# Altium project PCB_Project.PrjPcb (part 1 of 2)
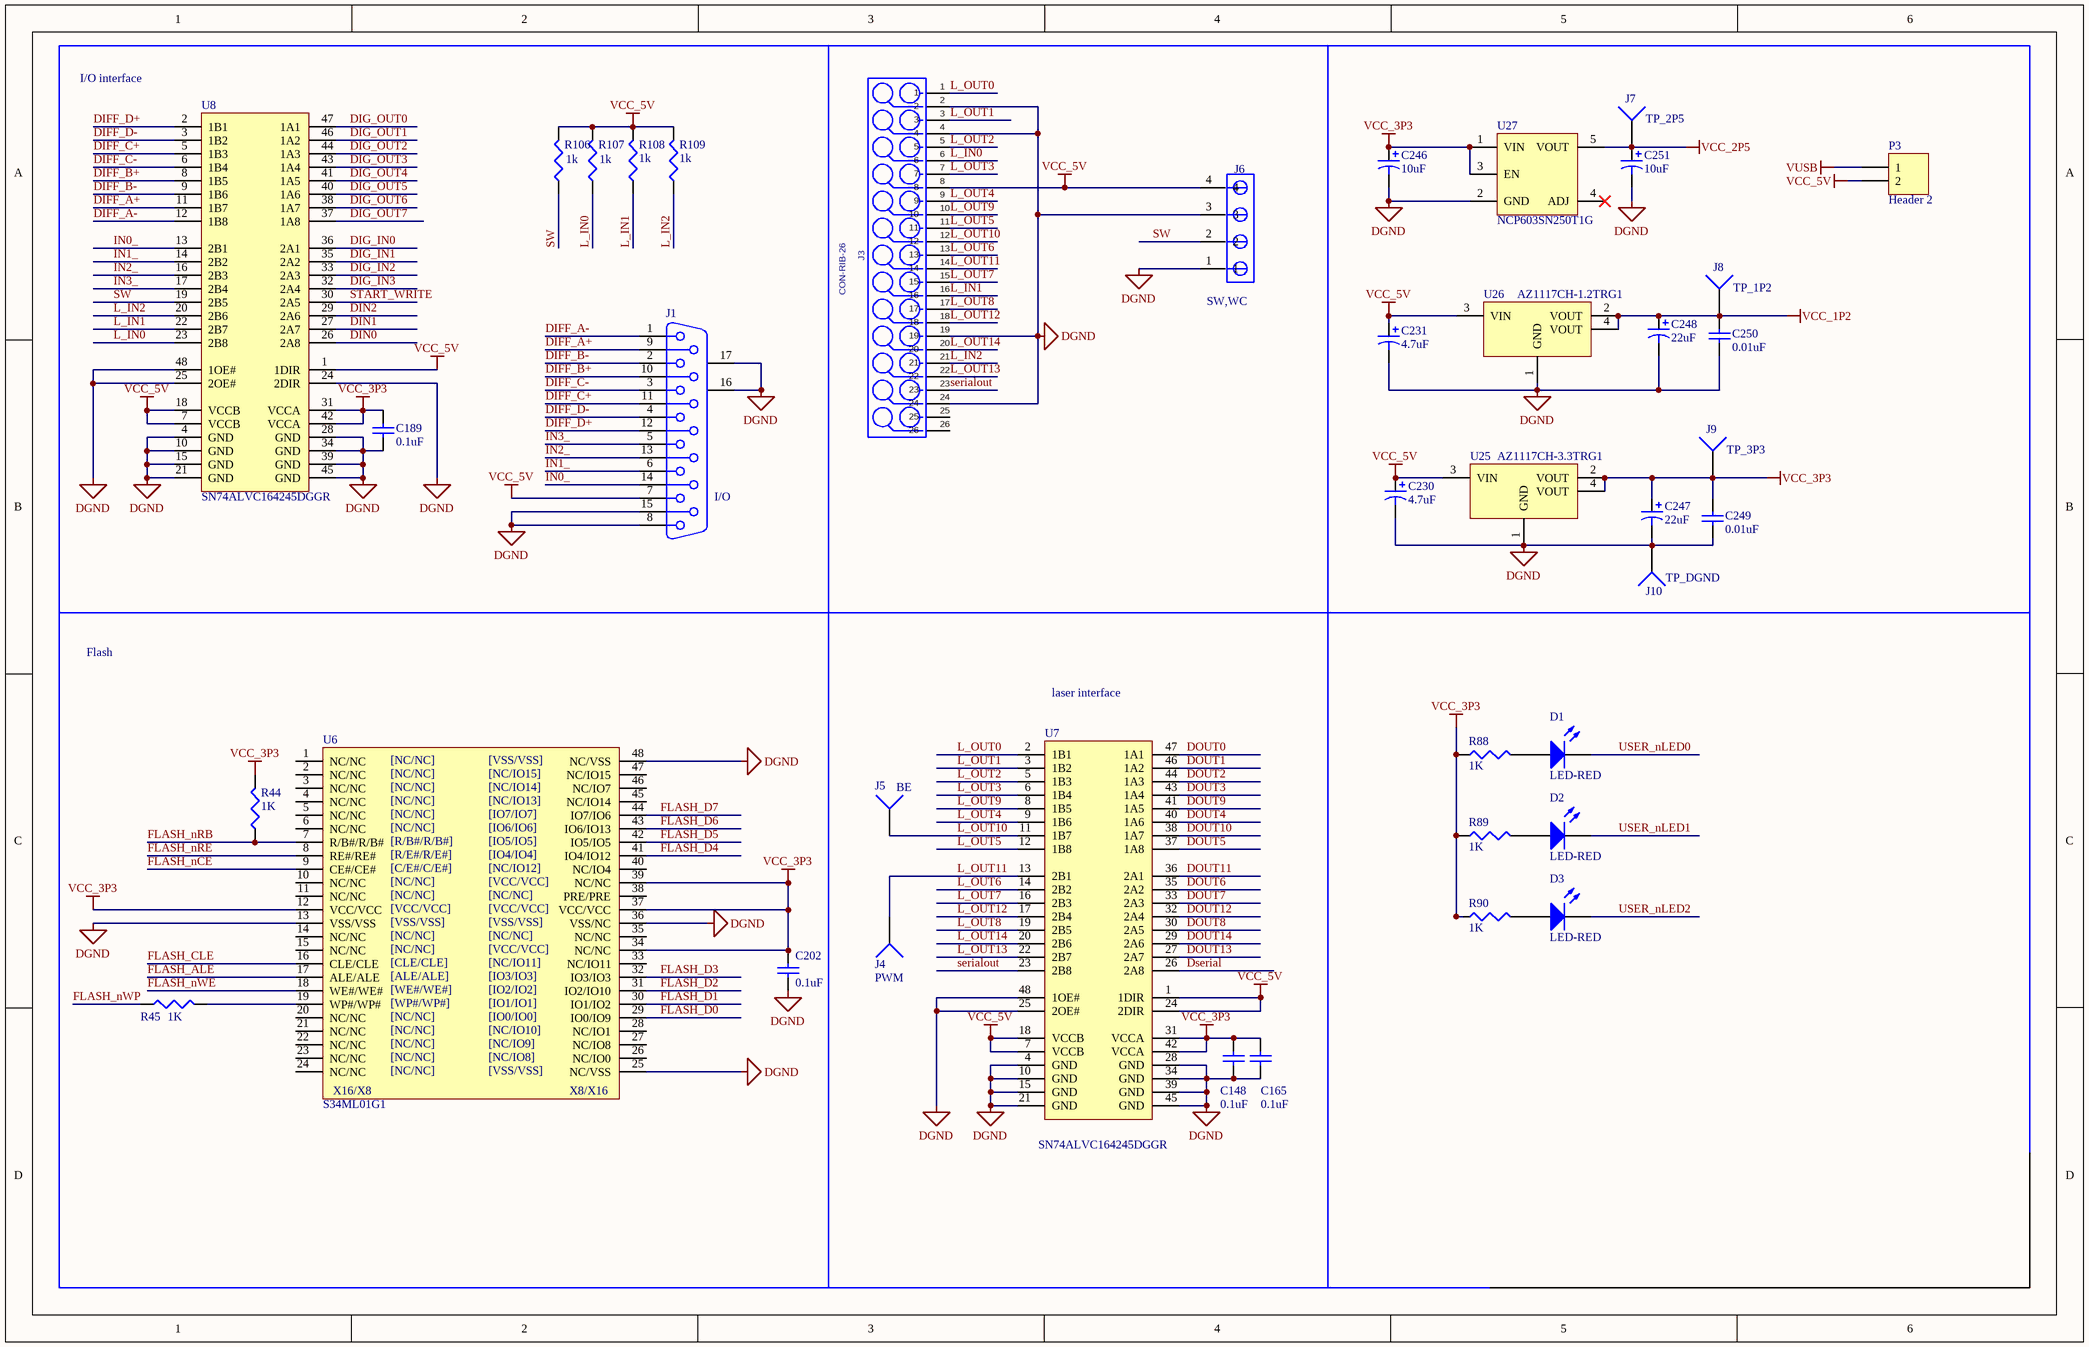
[diagram p0: interface.SchDoc]
6 sheets, 207 parts. Net scope: global (net labels, ports and power ports of the same name join across sheets).
Board file: pcb_apex_v3.2.1.PcbDoc
Sheets:
  interface.SchDoc
  fx3_a.SchDoc
  fx3_b.SchDoc
  ep4ce30_a.SchDoc
  ep4ce30_b.SchDoc
  ep4ce30_c.SchDoc

## Sheet interface.SchDoc: Interface
size OrCAD B; CheckedBy: liuchao; DrawnBy: liuchao; DocumentNumber: APEX-USB7; Revision: 3.0.0; SheetNumber: 7; SheetTotal: 9

### Parts
C148  value 0.1uF  [C_0402]  (hidden comment: Capacitor)
C165  value 0.1uF  [C_0402]  (hidden comment: Capacitor)
C189  value 0.1uF  [C_0402]  (hidden comment: Capacitor)
C202  value 0.1uF  [C_0402]  (hidden comment: Capacitor)
C230  value 4.7uF  [CAP_B]  (hidden comment: Polarized Capacitor)
C231  value 4.7uF  [CAP_B]  (hidden comment: Polarized Capacitor)
C246  value 10uF  [CAP_B]  (hidden comment: Polarized Capacitor)
C247  value 22uF  [CAP_B]  (hidden comment: Polarized Capacitor)
C248  value 22uF  [CAP_B]  (hidden comment: Polarized Capacitor)
C249  value 0.01uF  [C_0402]  (hidden comment: Capacitor)
C250  value 0.01uF  [C_0402]  (hidden comment: Capacitor)
C251  value 10uF  [CAP_B]  (hidden comment: Polarized Capacitor)
D1  LED-RED  [3.2X1.6X1.1]
D2  LED-RED  [3.2X1.6X1.1]
D3  LED-RED  [3.2X1.6X1.1]
J1  I/O  [DB15]
J3  CON-RIB-26  [H26-2P54-DIP]
J4  PWM  [1PAD]
J5  BE  [1PAD]
J6  value SW,WC  [2510-4P]  (hidden comment: SIP-4P-100)
J7  TP_2P5  [1PAD]
J8  TP_1P2  [1PAD]
J9  TP_3P3  [1PAD]
J10  TP_DGND  [1PAD]
P3  Header 2  [HDR1X2]
R44  value 1K  [J1-0603]  (hidden comment: Resistor)
R45  value 1K  [J1-0603]  (hidden comment: Resistor)
R88  value 1K  [J1-0603]  (hidden comment: Resistor)
R89  value 1K  [J1-0603]  (hidden comment: Resistor)
R90  value 1K  [J1-0603]  (hidden comment: Resistor)
R106  value 1k  [J1-0603]  (hidden comment: Resistor)
R107  value 1k  [J1-0603]  (hidden comment: Resistor)
R108  value 1k  [J1-0603]  (hidden comment: Resistor)
R109  value 1k  [J1-0603]  (hidden comment: Resistor)
U6  S34ML01G1  [TSOP48]
U7  SN74ALVC164245DGGR  [TSSOP48_N]
U8  SN74ALVC164245DGGR  [TSSOP48_N]
U25  AZ1117CH-3.3TRG1  [SOT223_N]
U26  AZ1117CH-1.2TRG1  [SOT223_N]
U27  NCP603SN250T1G  [TSOP_5]

### Nets
DGND: C148.2 C165.1 C189.1 C202.1 C230.2 C231.2 C246.2 C247.2 C248.2 C249.2 C250.2 C251.2 J1.8 J1.15 J1.16(MH1) J1.17(MH2) J3.2 J3.4 J3.19 J3.24 J6.1 J6.3 J10.1 U6.13(VSS/VSS) U6.25(NC/VSS) U6.36(VSS/NC) U6.48(NC/VSS) U7.4(GND) U7.10(GND) U7.15(GND) U7.21(GND) U7.25(2OE#) U7.28(GND) U7.34(GND) U7.39(GND) U7.45(GND) U7.48(1OE#) U8.4(GND) U8.10(GND) U8.15(GND) U8.21(GND) U8.24(2DIR) U8.25(2OE#) U8.28(GND) U8.34(GND) U8.39(GND) U8.45(GND) U8.48(1OE#) U25.1(GND) U26.1(GND) U27.2(GND)
VCC_1P2: C248.1 C250.1 J8.1 U26.2(VOUT) U26.4(VOUT)
VCC_2P5: C251.1 J7.1 U27.5(VOUT)
VCC_3P3: C148.1 C165.2 C189.2 C202.2 C246.1 C247.1 C249.1 J9.1 R44.2 R88.1 R89.1 R90.1 U6.12(VCC/VCC) U6.34(NC/NC) U6.37(VCC/VCC) U6.39(NC/NC) U7.31(VCCA) U7.42(VCCA) U8.31(VCCA) U8.42(VCCA) U25.2(VOUT) U25.4(VOUT) U27.1(VIN) U27.3(EN)
VCC_5V: C230.1 C231.1 J1.7 J3.8 J6.4 P3.2 R106.2 R107.2 R108.2 R109.2 U7.1(1DIR) U7.7(VCCB) U7.18(VCCB) U7.24(2DIR) U8.1(1DIR) U8.7(VCCB) U8.18(VCCB) U25.3(VIN) U26.3(VIN)
VUSB: P3.1
DIFF_A+: J1.9 U8.11(1B7)
DIFF_A-: J1.1 U8.12(1B8)
DIFF_B+: J1.10 U8.8(1B5)
DIFF_B-: J1.2 U8.9(1B6)
DIFF_C+: J1.11 U8.5(1B3)
DIFF_C-: J1.3 U8.6(1B4)
DIFF_D+: J1.12 U8.2(1B1)
DIFF_D-: J1.4 U8.3(1B2)
DIG_IN0: U8.36(2A1)
DIG_IN1: U8.35(2A2)
DIG_IN2: U8.33(2A3)
DIG_IN3: U8.32(2A4)
DIG_OUT0: U8.47(1A1)
DIG_OUT1: U8.46(1A2)
DIG_OUT2: U8.44(1A3)
DIG_OUT3: U8.43(1A4)
DIG_OUT4: U8.41(1A5)
DIG_OUT5: U8.40(1A6)
DIG_OUT6: U8.38(1A7)
DIG_OUT7: U8.37(1A8)
DIN0: U8.26(2A8)
DIN1: U8.27(2A7)
DIN2: U8.29(2A6)
DOUT0: U7.47(1A1)
DOUT1: U7.46(1A2)
DOUT2: U7.44(1A3)
DOUT3: U7.43(1A4)
DOUT4: U7.40(1A6)
DOUT5: U7.37(1A8)
DOUT6: U7.35(2A2)
DOUT7: U7.33(2A3)
DOUT8: U7.30(2A5)
DOUT9: U7.41(1A5)
DOUT10: U7.38(1A7)
DOUT11: U7.36(2A1)
DOUT12: U7.32(2A4)
DOUT13: U7.27(2A7)
DOUT14: U7.29(2A6)
Dserial: U7.26(2A8)
FLASH_ALE: U6.17(ALE/ALE)
FLASH_CLE: U6.16(CLE/CLE)
FLASH_D0: U6.29(IO0/IO9)
FLASH_D1: U6.30(IO1/IO2)
FLASH_D2: U6.31(IO2/IO10)
FLASH_D3: U6.32(IO3/IO3)
FLASH_D4: U6.41(IO4/IO12)
FLASH_D5: U6.42(IO5/IO5)
FLASH_D6: U6.43(IO6/IO13)
FLASH_D7: U6.44(IO7/IO6)
FLASH_nCE: U6.9(CE#/CE#)
FLASH_nRB: R44.1 U6.7(R/B#/R/B#)
FLASH_nRE: U6.8(RE#/RE#)
FLASH_nWE: U6.18(WE#/WE#)
FLASH_nWP: R45.1
IN0_: J1.14 U8.13(2B1)
IN1_: J1.6 U8.14(2B2)
IN2_: J1.13 U8.16(2B3)
IN3_: J1.5 U8.17(2B4)
L_IN0: J3.6 R107.1 U8.23(2B8)
L_IN1: J3.16 R108.1 U8.22(2B7)
L_IN2: J3.21 R109.1 U8.20(2B6)
L_OUT0: J3.1 U7.2(1B1)
L_OUT1: J3.3 U7.3(1B2)
L_OUT2: J3.5 U7.5(1B3)
L_OUT3: J3.7 U7.6(1B4)
L_OUT4: J3.9 U7.9(1B6)
L_OUT5: J3.11 U7.12(1B8)
L_OUT6: J3.13 U7.14(2B2)
L_OUT7: J3.15 U7.16(2B3)
L_OUT8: J3.17 U7.19(2B5)
L_OUT9: J3.10 U7.8(1B5)
L_OUT10: J3.12 J5.1 U7.11(1B7)
L_OUT11: J3.14 J4.1 U7.13(2B1)
L_OUT12: J3.18 U7.17(2B4)
L_OUT13: J3.22 U7.22(2B7)
L_OUT14: J3.20 U7.20(2B6)
serialout: J3.23 U7.23(2B8)
START_WRITE: U8.30(2A5)
SW: J6.2 R106.1 U8.19(2B5)
USER_nLED0: D1.2(K)
USER_nLED1: D2.2(K)
USER_nLED2: D3.2(K)
NetD1_1: D1.1(A) R88.2
NetD2_1: D2.1(A) R89.2
NetD3_1: D3.1(A) R90.2
NetR45_2: R45.2 U6.19(WP#/WP#)

Not connected (* = marked no-connect by the designer): J3 25 26; U6 1(NC/NC) 2(NC/NC) 3(NC/NC) 4(NC/NC) 5(NC/NC) 6(NC/NC) 10(NC/NC) 11(NC/NC) 14(NC/NC) 15(NC/NC) 20(NC/NC) 21(NC/NC) 22(NC/NC) 23(NC/NC) 24(NC/NC) 26(NC/IO0) 27(NC/IO8) 28(NC/IO1) 33(NC/IO11) 35(NC/NC) 38(PRE/PRE) 40(NC/IO4) 45(NC/IO14) 46(NC/IO7) 47(NC/IO15); U27 4(ADJ)*

### Notes on the sheet
- I/O interface
- Flash
- laser interface
- (in symbol K9F1GXXU0M) [NC/NC]; [VSS/VSS]; [NC/IO15]; [NC/IO14]; [NC/IO13]; [IO7/IO7]; [IO6/IO6]; [R/B#/R/B#]; [IO5/IO5]; [R/E#/R/E#]; [IO4/IO4]; [C/E#/C/E#]; [NC/IO12]; [VCC/VCC]; [CLE/CLE]; [NC/IO11]; [ALE/ALE]; [IO3/IO3]; [WE#/WE#]; [IO2/IO2]; [WP#/WP#]; [IO1/IO1]; [IO0/IO0]; [NC/IO10]; [NC/IO9]; [NC/IO8]; X16/X8; X8/X16

### Library data of the parts
C148 C165 C189 C202 C249 C250 = Cap Semi: Capacitor (Semiconductor SIM Model); Published: 8-Jun-2000; LatestRevisionDate: 29-May-2009; LatestRevisionNote: IPC-7351 Footprint Added.; PackageReference: C1206; Publisher: Altium Limited; PackageDescription: Chip Capacitor
C230 C231 C246-C248 C251 = Cap Pol3: Polarized Capacitor (Surface Mount); Published: 8-Jun-2000; LatestRevisionDate: 29-May-2009; LatestRevisionNote: IPC-7351 Footprint Added.; PackageReference: C0805; Publisher: Altium Limited; PackageDescription: Chip Capacitor
D1-D3 = LED2: Typical RED, GREEN, YELLOW, AMBER GaAs LED; Published: 8-Jun-2000; LatestRevisionDate: 17-Jul-2002; LatestRevisionNote: Re-released for DXP Platform.; PackageVersion: Feb-2002; PackageReference: 3.2X1.6X1.1; Publisher: Altium Limited; PackageDescription: SM LED; 2 Flat Leads
J1 = D Connector 15: Receptacle Assembly, 15 Position, Right Angle; PackageDocument: O; Positions: 15; Published: 15-Jun-2001; LatestRevisionDate: 17-Jul-2002; LatestRevisionNote: Re-released for DXP Platform.; DatasheetDocument: 1-Sep-99; PackageReference: 788757; Publisher: Altium Limited; Orientation: Right Angle; Gender: Receptacle
J3 = CON-RIB-26: CONN HEADER 26POS DUAL VERT PCB; Manufacturer #1: dg-key 609-1756-ND; MFG #1: 71918-126LF; PCB DECAL: CON-RIB-26; Cost: 3.44; Manufacturer #2: FCI
J4 J5 J7-J10 = Socket: LatestRevisionDate: 17-Jul-2002; LatestRevisionNote: Re-released for DXP Platform.; Publisher: Altium Limited
J6 = HEADER_4: Manufacturer #1: DIGIKEY-WM4802-ND; Spil Part #: 70543-0003; PCB DECAL: SIP-4P; Cost: 1.14
P3 = Header 2: Header, 2-Pin; LatestRevisionDate: 17-Jul-2002; LatestRevisionNote: Re-released for DXP Platform.; Publisher: Altium Limited
R44 R45 R88-R90 R106-R109 = Res3: Published: 8-Jun-2000; LatestRevisionDate: 29-May-2009; LatestRevisionNote: IPC-7351 Footprint Added.; PackageReference: J1-0603; Publisher: Altium Limited; PackageDescription: Chip Resistor
U6 = K9F1GXXU0M: NAND Flash
U7 U8 = SN74ALVC164245: Transceiver With 3-  State Outputs
U25 U26 = VR3.3V
U27 = NCP603SN: CMOS LDO Regulator

## Sheet fx3_a.SchDoc: CYUSB3014 - A
size OrCAD B; CheckedBy: liuchao; DrawnBy: liuchao; DocumentNumber: APEX-USB4; Revision: 3.0.0; SheetNumber: 4; SheetTotal: 9
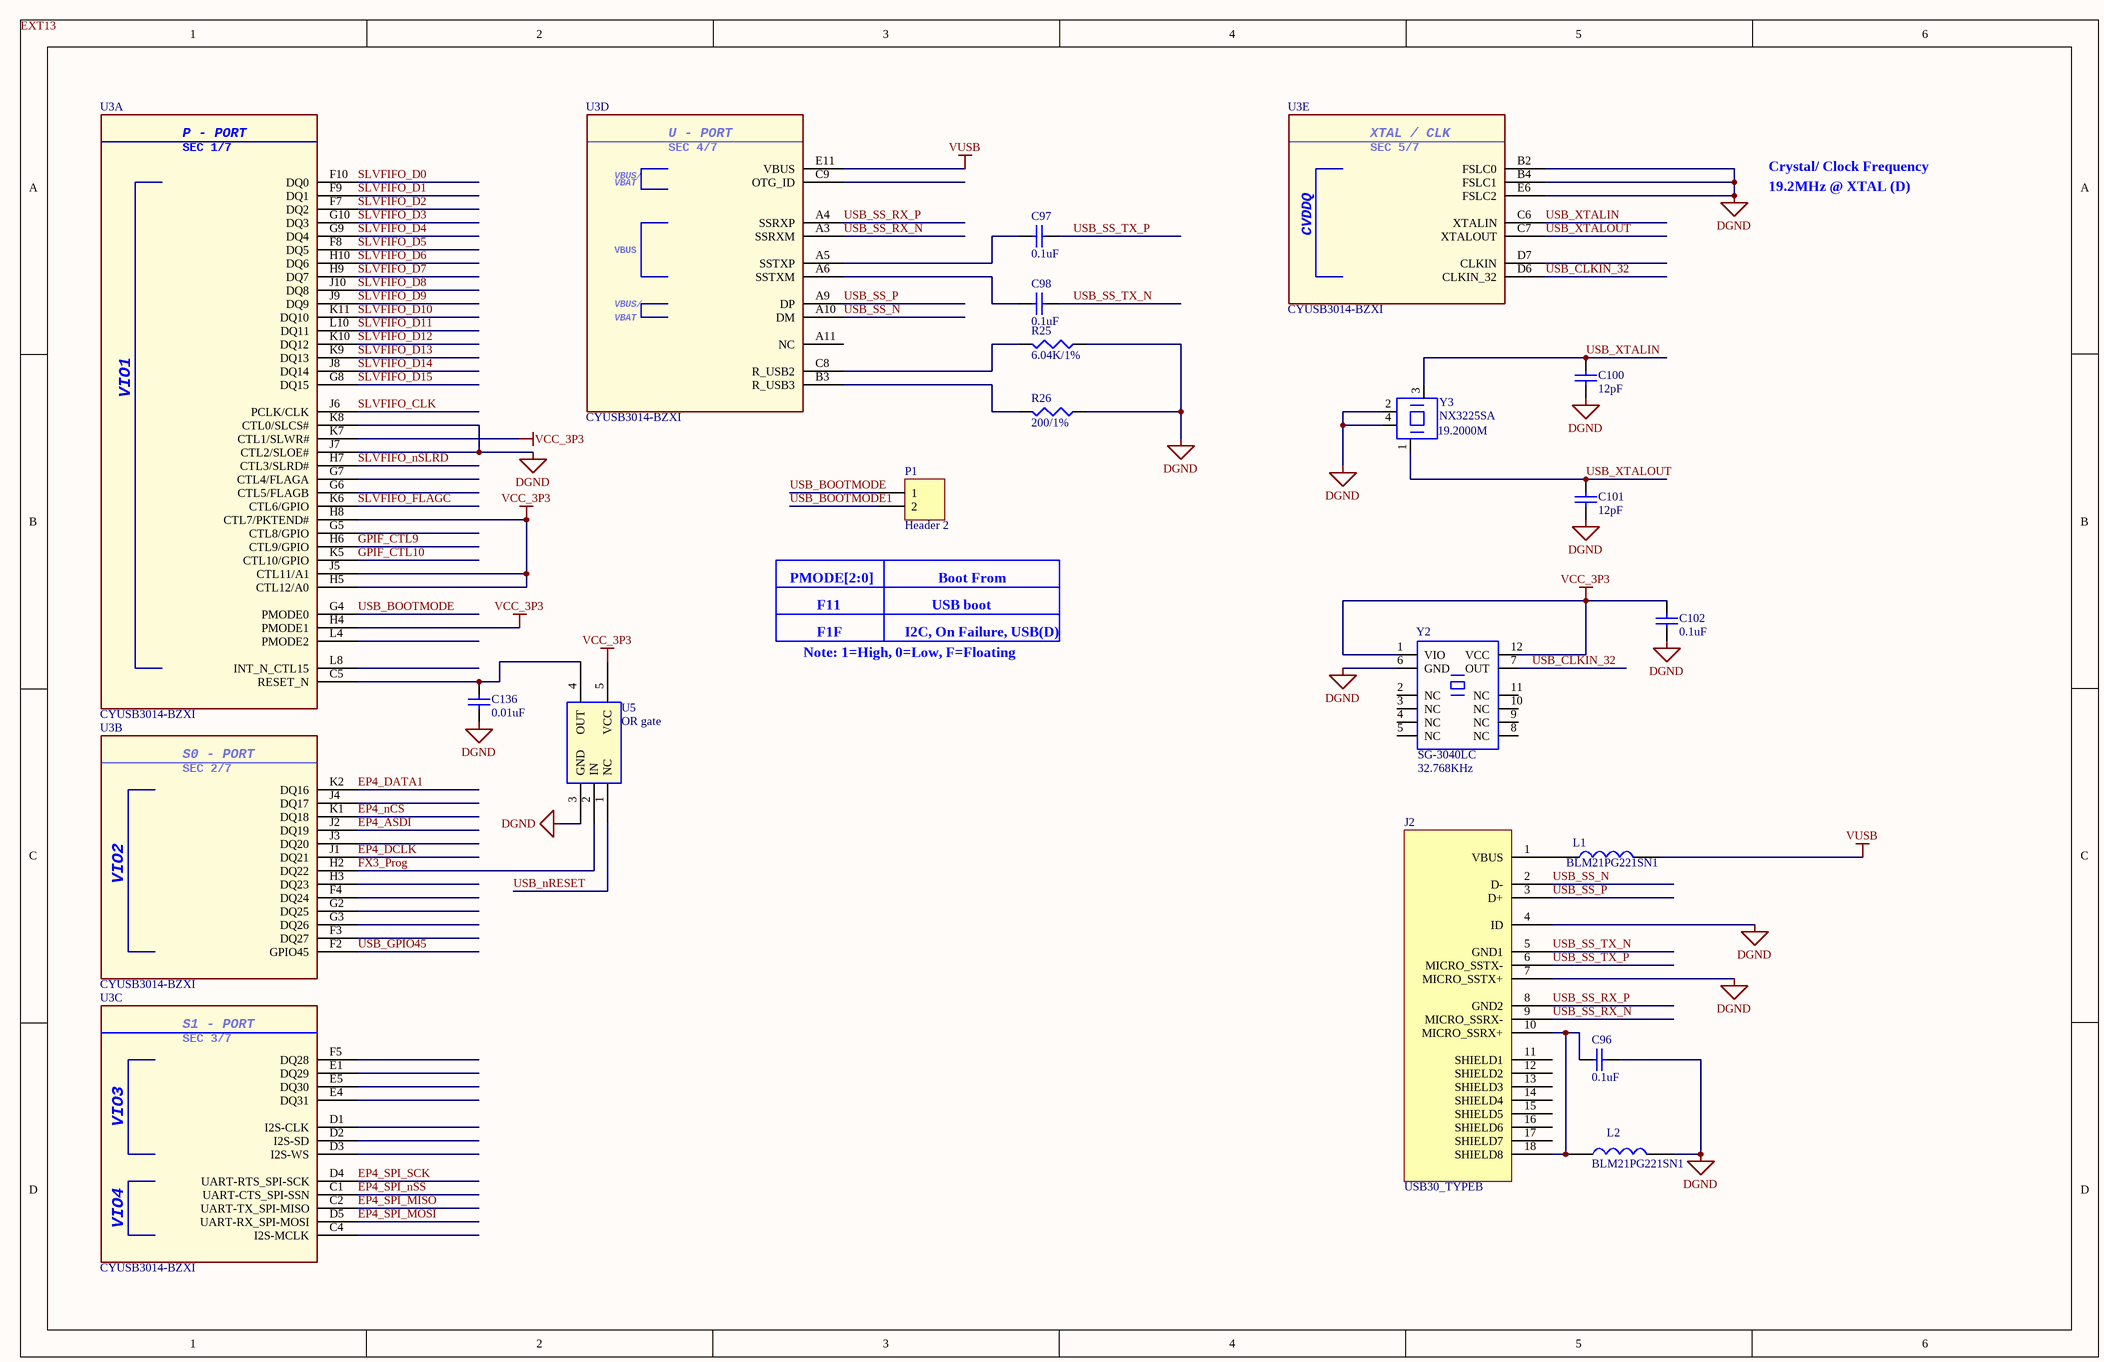
[diagram p1: fx3_a.SchDoc]

### Parts
C96  value 0.1uF  [C_0402]  (hidden comment: Capacitor)
C97  value 0.1uF  [C_0402]  (hidden comment: Capacitor)
C98  value 0.1uF  [C_0402]  (hidden comment: Capacitor)
C100  value 12pF  [C_0402]  (hidden comment: Capacitor)
C101  value 12pF  [C_0402]  (hidden comment: Capacitor)
C102  value 0.1uF  [C_0402]  (hidden comment: Capacitor)
C136  value 0.01uF  [C_0402]  (hidden comment: Capacitor)
J2  USB30_TYPEB  [USB3.0 typeB]
L1  BLM21PG221SN1  [SMD_0805]
L2  BLM21PG221SN1  [SMD_0805]
P1  Header 2  [HDR1X2]
R25  value 6.04K/1%  [J1-0603]  (hidden comment: Resistor)
R26  value 200/1%  [J1-0603]  (hidden comment: Resistor)
U3  CYUSB3014-BZXI  [CYP-BZX121]  (parts A,B,C,D,E of 7)
U5  OR gate  [TC7SET08FU]
Y2  SG-3040LC  value 32.768KHz  [SG-3040LC]
Y3  NX3225SA  value 19.2000M  [CRYSTAL_SMD_32X25]

### Nets
DGND: C96.2 C100.1 C101.1 C102.1 C136.2 J2.4(ID) J2.7(MICRO_SSTX+) L2.2 R25.1 R26.1 U3.B2(FSLC0) U3.B4(FSLC1) U3.E6(FSLC2) U3.J7(CTL2/SLOE#) U3.K8(CTL0/SLCS#) U5.3(GND) Y2.6(GND) Y3.2 Y3.4
VCC_3P3: C102.2 U3.H4(PMODE1) U3.H5(CTL12/A0) U3.H8(CTL7/PKTEND#) U3.J5(CTL11/A1) U3.K7(CTL1/SLWR#) U5.5(VCC) Y2.1(VIO) Y2.12(VCC)
VUSB: L1.2 U3.E11(VBUS)
EP4_ASDI: U3.J2(DQ19)
EP4_DATA1: U3.K2(DQ16)
EP4_DCLK: U3.J1(DQ21)
EP4_nCS: U3.K1(DQ18)
EP4_SPI_MISO: U3.C2(UART-TX_SPI-MISO)
EP4_SPI_MOSI: U3.D5(UART-RX_SPI-MOSI)
EP4_SPI_nSS: U3.C1(UART-CTS_SPI-SSN)
EP4_SPI_SCK: U3.D4(UART-RTS_SPI-SCK)
FX3_Prog: U3.H2(DQ22) U5.2(IN)
GPIF_CTL9: U3.H6(CTL9/GPIO)
GPIF_CTL10: U3.K5(CTL10/GPIO)
SLVFIFO_CLK: U3.J6(PCLK/CLK)
SLVFIFO_D0: U3.F10(DQ0)
SLVFIFO_D1: U3.F9(DQ1)
SLVFIFO_D2: U3.F7(DQ2)
SLVFIFO_D3: U3.G10(DQ3)
SLVFIFO_D4: U3.G9(DQ4)
SLVFIFO_D5: U3.F8(DQ5)
SLVFIFO_D6: U3.H10(DQ6)
SLVFIFO_D7: U3.H9(DQ7)
SLVFIFO_D8: U3.J10(DQ8)
SLVFIFO_D9: U3.J9(DQ9)
SLVFIFO_D10: U3.K11(DQ10)
SLVFIFO_D11: U3.L10(DQ11)
SLVFIFO_D12: U3.K10(DQ12)
SLVFIFO_D13: U3.K9(DQ13)
SLVFIFO_D14: U3.J8(DQ14)
SLVFIFO_D15: U3.G8(DQ15)
SLVFIFO_FLAGC: U3.K6(CTL6/GPIO)
SLVFIFO_nSLRD: U3.H7(CTL3/SLRD#)
USB_BOOTMODE: P1.1 U3.G4(PMODE0)
USB_BOOTMODE1: P1.2
USB_CLKIN_32: U3.D6(CLKIN_32) Y2.7(OUT)
USB_GPIO45: U3.F2(GPIO45)
USB_nRESET: U5.1(NC)
USB_SS_N: J2.2(D-) U3.A10(DM)
USB_SS_P: J2.3(D+) U3.A9(DP)
USB_SS_RX_N: J2.9(MICRO_SSRX-) U3.A3(SSRXM)
USB_SS_RX_P: J2.8(GND2) U3.A4(SSRXP)
USB_SS_TX_N: C98.2 J2.5(GND1)
USB_SS_TX_P: C97.2 J2.6(MICRO_SSTX-)
USB_XTALIN: C100.2 U3.C6(XTALIN) Y3.3
USB_XTALOUT: C101.2 U3.C7(XTALOUT) Y3.1
NetC96_1: C96.1 J2.10(MICRO_SSRX+) J2.18(SHIELD8) L2.1
NetC97_1: C97.1 U3.A5(SSTXP)
NetC98_1: C98.1 U3.A6(SSTXM)
NetC136_1: C136.1 U3.C5(RESET_N) U5.4(OUT)
NetJ2_1: J2.1(VBUS) L1.1
NetR25_2: R25.2 U3.C8(R_USB2)
NetR26_2: R26.2 U3.B3(R_USB3)

Not connected (* = marked no-connect by the designer): J2 11(SHIELD1) 12(SHIELD2) 13(SHIELD3) 14(SHIELD4) 15(SHIELD5) 16(SHIELD6) 17(SHIELD7); U3 A11(NC) C4(I2S-MCLK) C9(OTG_ID) D1(I2S-CLK) D2(I2S-SD) D3(I2S-WS) D7(CLKIN) E1(DQ29) E4(DQ31) E5(DQ30) F3(DQ27) F4(DQ24) F5(DQ28) G2(DQ25) G3(DQ26) G5(CTL8/GPIO) G6(CTL5/FLAGB) G7(CTL4/FLAGA) H3(DQ23) J3(DQ20) J4(DQ17) L4(PMODE2) L8(INT_N_CTL15); Y2 2(NC) 3(NC) 4(NC) 5(NC) 8(NC) 9(NC) 10(NC) 11(NC)

### Notes on the sheet
- Crystal/ Clock Frequency
- 19.2MHz @ XTAL (D)
- PMODE[2:0]
- F11
- F1F
- I2C, On Failure, USB(D)
- USB boot
- Boot From
- Note: 1=High, 0=Low, F=Floating
- Labels drawn without touching a wire or pin: EXT13
- (in symbol CYUSB30XX, part A) P - PORT; SEC 1/7; VIO1
- (in symbol CYUSB30XX, part B) S0 - PORT; SEC 2/7
- (in symbol CYUSB30XX, part C) S1 - PORT; SEC 3/7
- (in symbol CYUSB30XX, part D) U - PORT; SEC 4/7; VBUS/
- (in symbol CYUSB30XX, part E) XTAL / CLK; SEC 5/7

### Library data of the parts
C96-C98 C100-C102 C136 = Cap Semi: Capacitor (Semiconductor SIM Model); Published: 8-Jun-2000; LatestRevisionDate: 29-May-2009; LatestRevisionNote: IPC-7351 Footprint Added.; PackageReference: C1206; Publisher: Altium Limited; PackageDescription: Chip Capacitor
J2 = USB30_TYPEB: USB30_MICRO_TYPEB; pin to pad: 10>A 11>none 12>none 13>none 14>none 15>none 16>none 17>none 18>B
L1 L2 = BLM21PXXX: Chip Ferrite Bead
P1 = Header 2: Header, 2-Pin; LatestRevisionDate: 17-Jul-2002; LatestRevisionNote: Re-released for DXP Platform.; Publisher: Altium Limited
R25 R26 = Res3: Published: 8-Jun-2000; LatestRevisionDate: 29-May-2009; LatestRevisionNote: IPC-7351 Footprint Added.; PackageReference: J1-0603; Publisher: Altium Limited; PackageDescription: Chip Resistor
U3 = CYUSB30XX: FX3 CYUSB3014
U5 = INVERTER
Y2 = SG3040: CRYSTAL
Y3 = NX3225SA: CRYSTAL

## Sheet fx3_b.SchDoc: CYUSB3014 - B
size OrCAD B; CheckedBy: liuchao; DrawnBy: liuchao; DocumentNumber: APEX-USB5; Revision: 3.0.0; SheetNumber: 5; SheetTotal: 9
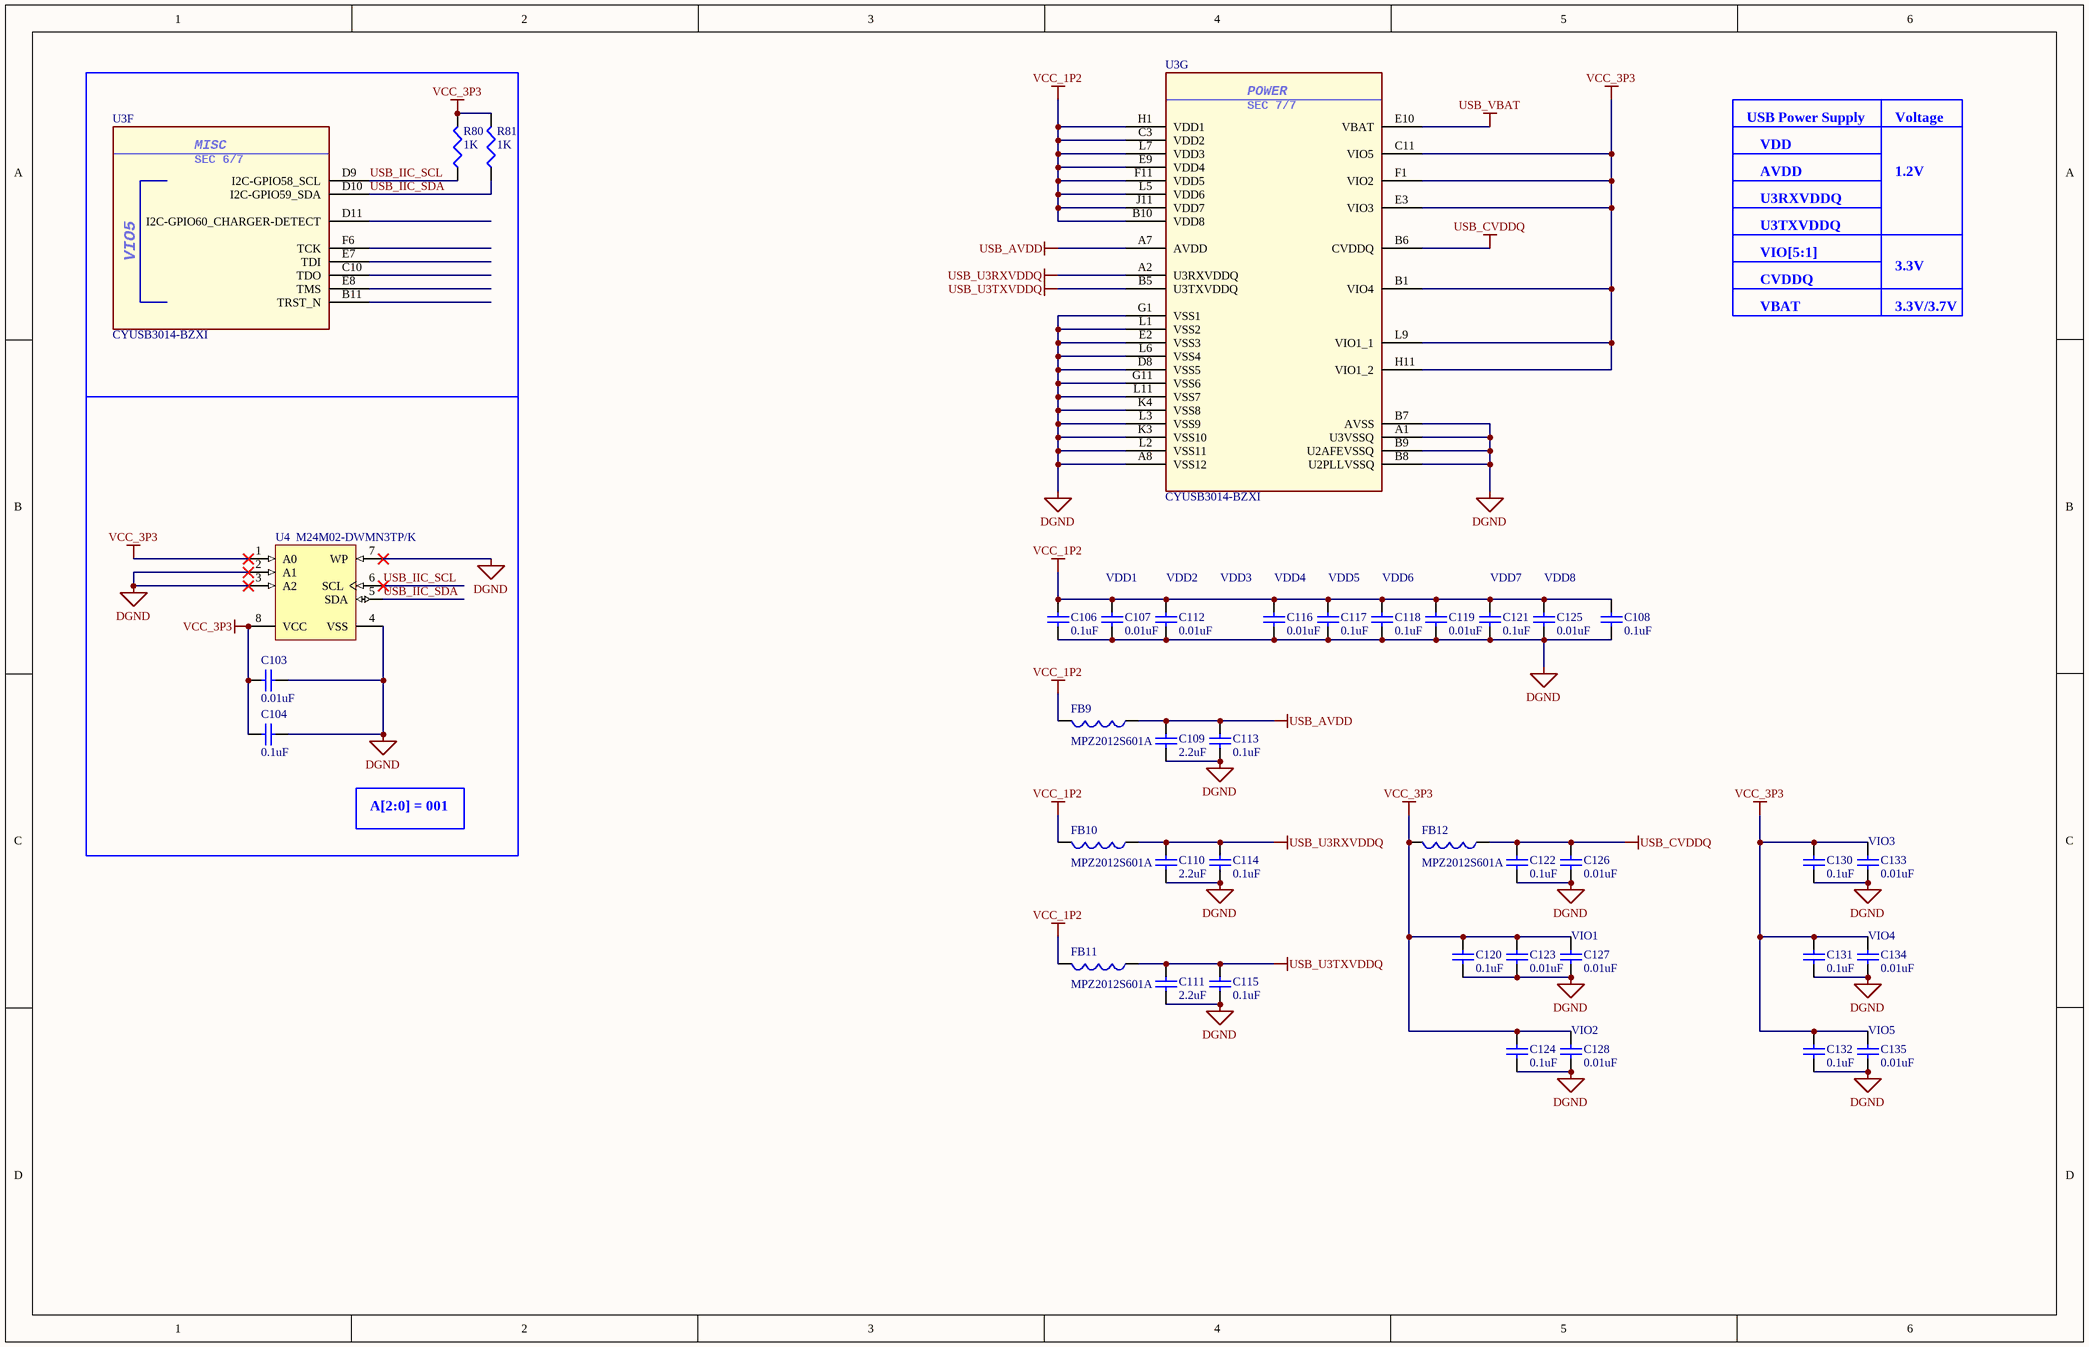
[diagram p2: fx3_b.SchDoc]

### Parts
C103  value 0.01uF  [C_0402]  (hidden comment: Capacitor)
C104  value 0.1uF  [C_0402]  (hidden comment: Capacitor)
C106  value 0.1uF  [C_0402]  (hidden comment: Capacitor)
C107  value 0.01uF  [C_0402]  (hidden comment: Capacitor)
C108  value 0.1uF  [C_0402]  (hidden comment: Capacitor)
C109  value 2.2uF  [C_0402]  (hidden comment: Capacitor)
C110  value 2.2uF  [C_0402]  (hidden comment: Capacitor)
C111  value 2.2uF  [C_0402]  (hidden comment: Capacitor)
C112  value 0.01uF  [C_0402]  (hidden comment: Capacitor)
C113  value 0.1uF  [C_0402]  (hidden comment: Capacitor)
C114  value 0.1uF  [C_0402]  (hidden comment: Capacitor)
C115  value 0.1uF  [C_0402]  (hidden comment: Capacitor)
C116  value 0.01uF  [C_0402]  (hidden comment: Capacitor)
C117  value 0.1uF  [C_0402]  (hidden comment: Capacitor)
C118  value 0.1uF  [C_0402]  (hidden comment: Capacitor)
C119  value 0.01uF  [C_0402]  (hidden comment: Capacitor)
C120  value 0.1uF  [C_0402]  (hidden comment: Capacitor)
C121  value 0.1uF  [C_0402]  (hidden comment: Capacitor)
C122  value 0.1uF  [C_0402]  (hidden comment: Capacitor)
C123  value 0.01uF  [C_0402]  (hidden comment: Capacitor)
C124  value 0.1uF  [C_0402]  (hidden comment: Capacitor)
C125  value 0.01uF  [C_0402]  (hidden comment: Capacitor)
C126  value 0.01uF  [C_0402]  (hidden comment: Capacitor)
C127  value 0.01uF  [C_0402]  (hidden comment: Capacitor)
C128  value 0.01uF  [C_0402]  (hidden comment: Capacitor)
C130  value 0.1uF  [C_0402]  (hidden comment: Capacitor)
C131  value 0.1uF  [C_0402]  (hidden comment: Capacitor)
C132  value 0.1uF  [C_0402]  (hidden comment: Capacitor)
C133  value 0.01uF  [C_0402]  (hidden comment: Capacitor)
C134  value 0.01uF  [C_0402]  (hidden comment: Capacitor)
C135  value 0.01uF  [C_0402]  (hidden comment: Capacitor)
FB9  MPZ2012S601A  [SMD_0805]
FB10  MPZ2012S601A  [SMD_0805]
FB11  MPZ2012S601A  [SMD_0805]
FB12  MPZ2012S601A  [SMD_0805]
R80  value 1K  [J1-0603]  (hidden comment: Resistor)
R81  value 1K  [J1-0603]  (hidden comment: Resistor)
U3  CYUSB3014-BZXI  [CYUSB301X_BGA121x11]  (parts F,G of 7)
U4  M24M02-DWMN3TP/K  [SOIC-SN8_N]

### Nets
DGND: C103.2 C104.2 C106.2 C107.2 C108.2 C109.2 C110.2 C111.2 C112.2 C113.2 C114.2 C115.2 C116.2 C117.2 C118.2 C119.2 C120.2 C121.2 C122.2 C123.2 C124.2 C125.2 C126.2 C127.2 C128.2 C130.2 C131.2 C132.2 C133.2 C134.2 C135.2 U3.A1(U3VSSQ) U3.A8(VSS12) U3.B7(AVSS) U3.B8(U2PLLVSSQ) U3.B9(U2AFEVSSQ) U3.D8(VSS5) U3.E2(VSS3) U3.G1(VSS1) U3.G11(VSS6) U3.K3(VSS10) U3.K4(VSS8) U3.L1(VSS2) U3.L2(VSS11) U3.L3(VSS9) U3.L6(VSS4) U3.L11(VSS7) U4.2(A1) U4.3(A2) U4.4(VSS) U4.7(WP)
USB_AVDD: C109.1 C113.1 FB9.1 U3.A7(AVDD)
USB_CVDDQ: C122.1 C126.1 FB12.1 U3.B6(CVDDQ)
USB_U3RXVDDQ: C110.1 C114.1 FB10.1 U3.A2(U3RXVDDQ)
USB_U3TXVDDQ: C111.1 C115.1 FB11.1 U3.B5(U3TXVDDQ)
USB_VBAT: U3.E10(VBAT)
VCC_1P2: C106.1 C107.1 C108.1 C112.1 C116.1 C117.1 C118.1 C119.1 C121.1 C125.1 FB9.2 FB10.2 FB11.2 U3.B10(VDD8) U3.C3(VDD2) U3.E9(VDD4) U3.F11(VDD5) U3.H1(VDD1) U3.J11(VDD7) U3.L5(VDD6) U3.L7(VDD3)
VCC_3P3: C103.1 C104.1 C120.1 C123.1 C124.1 C127.1 C128.1 C130.1 C131.1 C132.1 C133.1 C134.1 C135.1 FB12.2 R80.2 R81.2 U3.B1(VIO4) U3.C11(VIO5) U3.E3(VIO3) U3.F1(VIO2) U3.H11(VIO1_2) U3.L9(VIO1_1) U4.1(A0) U4.8(VCC)
USB_IIC_SCL: R80.1 U3.D9(I2C-GPIO58_SCL) U4.6(SCL)
USB_IIC_SDA: R81.1 U3.D10(I2C-GPIO59_SDA) U4.5(SDA)

Not connected (* = marked no-connect by the designer): U3 B11(TRST_N) C10(TDO) D11(I2C-GPIO60_CHARGER-DETECT) E7(TDI) E8(TMS) F6(TCK)

### Notes on the sheet
- USB Power Supply
- VDD
- Voltage
- AVDD
- U3RXVDDQ
- 1.2V
- VIO[5:1]
- U3TXVDDQ
- CVDDQ
- 3.3V
- VBAT
- 3.3V/3.7V
- (near C107) VDD1
- (near C112) VDD2
- VDD3
- VDD4
- VDD5
- VDD6
- VDD7
- (near C125) VDD8
- A[2:0] = 001
- (near C133) VIO3
- (near C127) VIO1
- (near C134) VIO4
- (near C128) VIO2
- (near C135) VIO5
- (in symbol CYUSB30XX, part F) MISC; SEC 6/7
- (in symbol CYUSB30XX, part G) POWER; SEC 7/7

### Library data of the parts
C103 C104 C106-C128 C130-C135 = Cap Semi: Capacitor (Semiconductor SIM Model); Published: 8-Jun-2000; LatestRevisionDate: 29-May-2009; LatestRevisionNote: IPC-7351 Footprint Added.; PackageReference: C1206; Publisher: Altium Limited; PackageDescription: Chip Capacitor
FB9-FB12 = MPZ2012X
R80 R81 = Res3: Published: 8-Jun-2000; LatestRevisionDate: 29-May-2009; LatestRevisionNote: IPC-7351 Footprint Added.; PackageReference: J1-0603; Publisher: Altium Limited; PackageDescription: Chip Resistor
U3 = CYUSB30XX: FX3 CYUSB3014
U4 = 24LC256-I/SN: 256Kbit, 400kHz, 2.5V, I2C Serial EEPROM, 8-Pin SOIC 150mil, Industrial Temperature; Manufacturer: Microchip; DatasheetVersion: revP, Oct-2007; PackageVersion: revBB, Aug-2009; PackageReference: SOIC-SN8; PackageDescription: 8-Lead Plastic Small Outline (SN) - Narrow, 3.90mm Body [SOIC]; Supplier 1: Digi-Key; Supplier Part Number 1: 24LC256-I/SN-ND; Supplier 2: Farnell; Supplier Part Number 2: 9757996; Supplier 3: Farnell; Supplier Part Number 3: 1660005; Supplier 4: Newark; Supplier Part Number 4: 27C9144; Supplier 5: Mouser; Supplier Part Number 5: 579-24LC256-I/SN; Mounting Technology: Surface Mount; Code_JEDEC: MS-012; Code_IPC: SOIC127P600-8; PartNumber: 24LC256-I/SN; ComponentLink1Description: Manufacturer URL; ComponentLink1URL: http://www.microchip.com/; ComponentLink2Description: Datasheet; ComponentLink2URL: http://ww1.microchip.com/downloads/en/DeviceDoc/21203P.pdf; ComponentLink3Description: Package Specification; ComponentLink3URL: http://www.microchip.com/stellent/groups/techpub_sg/documents/packagingspec/en012702.pdf

## Sheet ep4ce30_a.SchDoc: EP4CE30F23 - A
size OrCAD B; CheckedBy: liuchao; DrawnBy: liuchao; DocumentNumber: APEX-USB1; Revision: 3.0.0; SheetNumber: 1; SheetTotal: 9
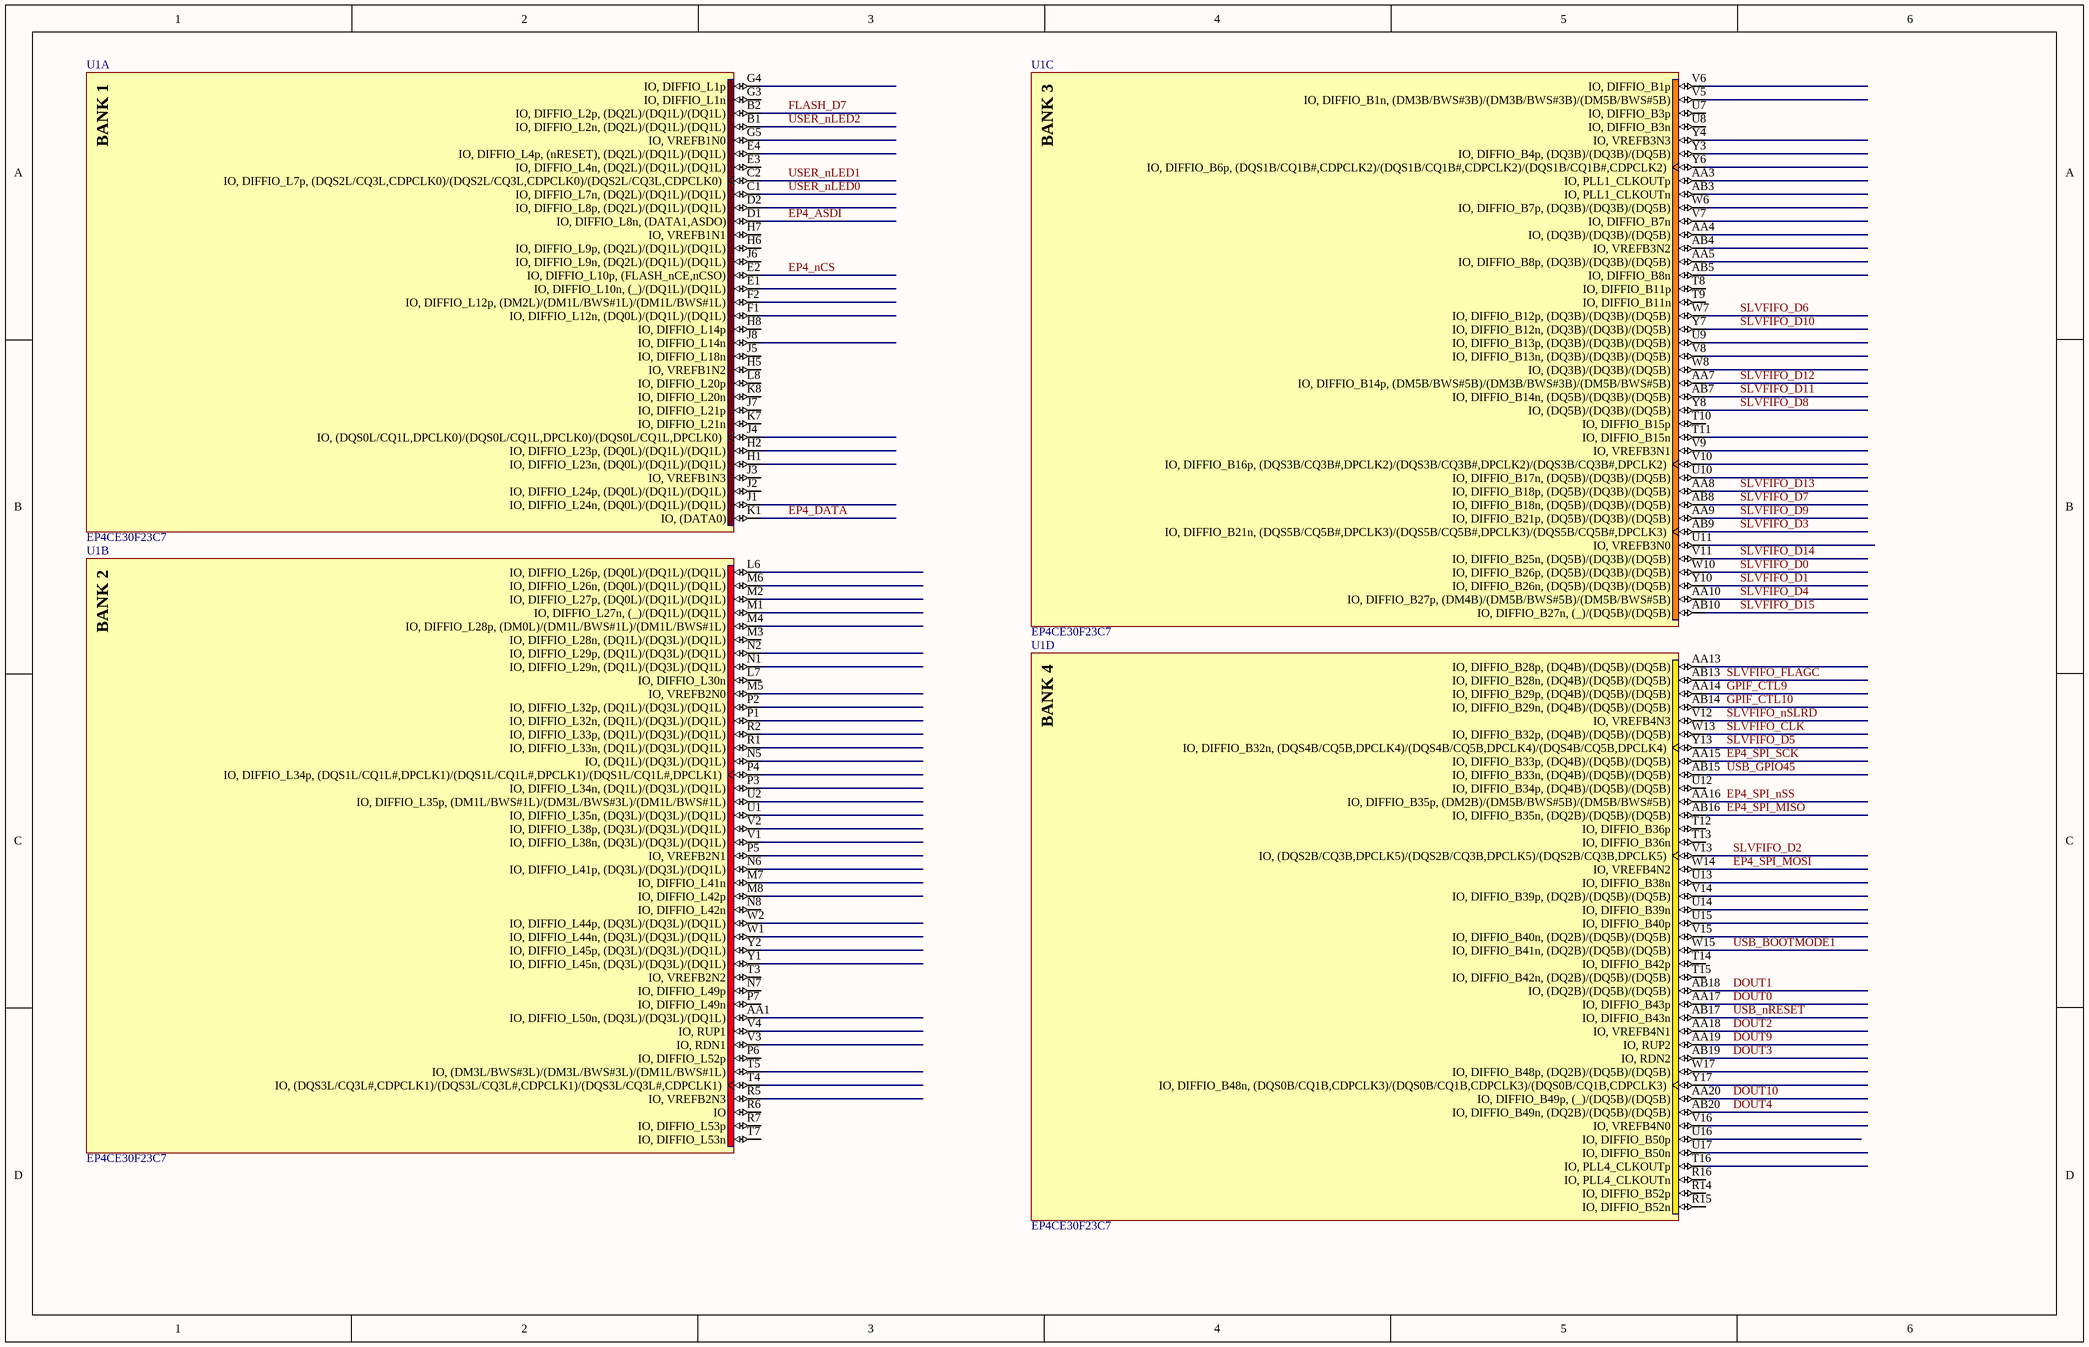
[diagram p3: ep4ce30_a.SchDoc]

### Parts
U1  EP4CE30F23C7  [FBGA484_A-240]  (parts A,B,C,D of 13)

### Nets
DOUT0: U1.AA17(IO,_DIFFIO_B43p)
DOUT1: U1.AB18(IO,_(DQ2B)/(DQ5B)/(DQ5B))
DOUT2: U1.AA18(IO,_VREFB4N1)
DOUT3: U1.AB19(IO,_RDN2)
DOUT4: U1.AB20(IO,_DIFFIO_B49n,_(DQ2B)/(DQ5B)/(DQ5B))
DOUT9: U1.AA19(IO,_RUP2)
DOUT10: U1.AA20(IO,_DIFFIO_B49p,_(_)/(DQ5B)/(DQ5B))
EP4_ASDI: U1.D1(IO,_DIFFIO_L8n,_(DATA1,ASDO))
EP4_DATA: U1.K1(IO,_(DATA0))
EP4_nCS: U1.E2(IO,_DIFFIO_L10p,_(FLASH_nCE,nCSO))
EP4_SPI_MISO: U1.AB16(IO,_DIFFIO_B35n,_(DQ2B)/(DQ5B)/(DQ5B))
EP4_SPI_MOSI: U1.W14(IO,_VREFB4N2)
EP4_SPI_nSS: U1.AA16(IO,_DIFFIO_B35p,_(DM2B)/(DM5B/BWS#5B)/(DM5B/BWS#5B))
EP4_SPI_SCK: U1.AA15(IO,_DIFFIO_B33p,_(DQ4B)/(DQ5B)/(DQ5B))
FLASH_D7: U1.B2(IO,_DIFFIO_L2p,_(DQ2L)/(DQ1L)/(DQ1L))
GPIF_CTL9: U1.AA14(IO,_DIFFIO_B29p,_(DQ4B)/(DQ5B)/(DQ5B))
GPIF_CTL10: U1.AB14(IO,_DIFFIO_B29n,_(DQ4B)/(DQ5B)/(DQ5B))
SLVFIFO_CLK: U1.W13(IO,_DIFFIO_B32p,_(DQ4B)/(DQ5B)/(DQ5B))
SLVFIFO_D0: U1.W10(IO,_DIFFIO_B26p,_(DQ5B)/(DQ3B)/(DQ5B))
SLVFIFO_D1: U1.Y10(IO,_DIFFIO_B26n,_(DQ5B)/(DQ3B)/(DQ5B))
SLVFIFO_D2: U1.V13(IO,_(DQS2B/CQ3B,DPCLK5)/(DQS2B/CQ3B,DPCLK5)/(DQS2B/CQ3B,DPCLK5))
SLVFIFO_D3: U1.AB9(IO,_DIFFIO_B21n,_(DQS5B/CQ5B#,DPCLK3)/(DQS5B/CQ5B#,DPCLK3)/(DQS5B/CQ5B#,DPCLK3))
SLVFIFO_D4: U1.AA10(IO,_DIFFIO_B27p,_(DM4B)/(DM5B/BWS#5B)/(DM5B/BWS#5B))
SLVFIFO_D5: U1.Y13(IO,_DIFFIO_B32n,_(DQS4B/CQ5B,DPCLK4)/(DQS4B/CQ5B,DPCLK4)/(DQS4B/CQ5B,DPCLK4))
SLVFIFO_D6: U1.W7(IO,_DIFFIO_B12p,_(DQ3B)/(DQ3B)/(DQ5B))
SLVFIFO_D7: U1.AB8(IO,_DIFFIO_B18n,_(DQ5B)/(DQ3B)/(DQ5B))
SLVFIFO_D8: U1.Y8(IO,_(DQ5B)/(DQ3B)/(DQ5B))
SLVFIFO_D9: U1.AA9(IO,_DIFFIO_B21p,_(DQ5B)/(DQ3B)/(DQ5B))
SLVFIFO_D10: U1.Y7(IO,_DIFFIO_B12n,_(DQ3B)/(DQ3B)/(DQ5B))
SLVFIFO_D11: U1.AB7(IO,_DIFFIO_B14n,_(DQ5B)/(DQ3B)/(DQ5B))
SLVFIFO_D12: U1.AA7(IO,_DIFFIO_B14p,_(DM5B/BWS#5B)/(DM3B/BWS#3B)/(DM5B/BWS#5B))
SLVFIFO_D13: U1.AA8(IO,_DIFFIO_B18p,_(DQ5B)/(DQ3B)/(DQ5B))
SLVFIFO_D14: U1.V11(IO,_DIFFIO_B25n,_(DQ5B)/(DQ3B)/(DQ5B))
SLVFIFO_D15: U1.AB10(IO,_DIFFIO_B27n,_(_)/(DQ5B)/(DQ5B))
SLVFIFO_FLAGC: U1.AB13(IO,_DIFFIO_B28n,_(DQ4B)/(DQ5B)/(DQ5B))
SLVFIFO_nSLRD: U1.V12(IO,_VREFB4N3)
USB_BOOTMODE1: U1.W15(IO,_DIFFIO_B41n,_(DQ2B)/(DQ5B)/(DQ5B))
USB_GPIO45: U1.AB15(IO,_DIFFIO_B33n,_(DQ4B)/(DQ5B)/(DQ5B))
USB_nRESET: U1.AB17(IO,_DIFFIO_B43n)
USER_nLED0: U1.C1(IO,_DIFFIO_L7n,_(DQ2L)/(DQ1L)/(DQ1L))
USER_nLED1: U1.C2(IO,_DIFFIO_L7p,_(DQS2L/CQ3L,CDPCLK0)/(DQS2L/CQ3L,CDPCLK0)/(DQS2L/CQ3L,CDPCLK0))
USER_nLED2: U1.B1(IO,_DIFFIO_L2n,_(DQ2L)/(DQ1L)/(DQ1L))

Not connected (* = marked no-connect by the designer): U1 AA1(IO,_DIFFIO_L50n,_(DQ3L)/(DQ3L)/(DQ1L)) AA3(IO,_PLL1_CLKOUTp) AA4(IO,_(DQ3B)/(DQ3B)/(DQ5B)) AA5(IO,_DIFFIO_B8p,_(DQ3B)/(DQ3B)/(DQ5B)) AA13(IO,_DIFFIO_B28p,_(DQ4B)/(DQ5B)/(DQ5B)) AB3(IO,_PLL1_CLKOUTn) AB4(IO,_VREFB3N2) AB5(IO,_DIFFIO_B8n) D2(IO,_DIFFIO_L8p,_(DQ2L)/(DQ1L)/(DQ1L)) E1(IO,_DIFFIO_L10n,_(_)/(DQ1L)/(DQ1L)) E3(IO,_DIFFIO_L4n,_(DQ2L)/(DQ1L)/(DQ1L)) E4(IO,_DIFFIO_L4p,_(nRESET),_(DQ2L)/(DQ1L)/(DQ1L)) F1(IO,_DIFFIO_L12n,_(DQ0L)/(DQ1L)/(DQ1L)) F2(IO,_DIFFIO_L12p,_(DM2L)/(DM1L/BWS#1L)/(DM1L/BWS#1L)) G3(IO,_DIFFIO_L1n) G4(IO,_DIFFIO_L1p) G5(IO,_VREFB1N0) H1(IO,_DIFFIO_L23n,_(DQ0L)/(DQ1L)/(DQ1L)) H2(IO,_DIFFIO_L23p,_(DQ0L)/(DQ1L)/(DQ1L)) H5(IO,_VREFB1N2) H6(IO,_DIFFIO_L9p,_(DQ2L)/(DQ1L)/(DQ1L)) H7(IO,_VREFB1N1) H8(IO,_DIFFIO_L14p) J1(IO,_DIFFIO_L24n,_(DQ0L)/(DQ1L)/(DQ1L)) J2(IO,_DIFFIO_L24p,_(DQ0L)/(DQ1L)/(DQ1L)) J3(IO,_VREFB1N3) J4(IO,_(DQS0L/CQ1L,DPCLK0)/(DQS0L/CQ1L,DPCLK0)/(DQS0L/CQ1L,DPCLK0)) J5(IO,_DIFFIO_L18n) J6(IO,_DIFFIO_L9n,_(DQ2L)/(DQ1L)/(DQ1L)) J7(IO,_DIFFIO_L21p) J8(IO,_DIFFIO_L14n) K7(IO,_DIFFIO_L21n) K8(IO,_DIFFIO_L20n) L6(IO,_DIFFIO_L26p,_(DQ0L)/(DQ1L)/(DQ1L)) L7(IO,_DIFFIO_L30n) L8(IO,_DIFFIO_L20p) M1(IO,_DIFFIO_L27n,_(_)/(DQ1L)/(DQ1L)) M2(IO,_DIFFIO_L27p,_(DQ0L)/(DQ1L)/(DQ1L)) M3(IO,_DIFFIO_L28n,_(DQ1L)/(DQ3L)/(DQ1L)) M4(IO,_DIFFIO_L28p,_(DM0L)/(DM1L/BWS#1L)/(DM1L/BWS#1L)) M5(IO,_VREFB2N0) M6(IO,_DIFFIO_L26n,_(DQ0L)/(DQ1L)/(DQ1L)) M7(IO,_DIFFIO_L41n) M8(IO,_DIFFIO_L42p) N1(IO,_DIFFIO_L29n,_(DQ1L)/(DQ3L)/(DQ1L)) N2(IO,_DIFFIO_L29p,_(DQ1L)/(DQ3L)/(DQ1L)) N5(IO,_(DQ1L)/(DQ3L)/(DQ1L)) N6(IO,_DIFFIO_L41p,_(DQ3L)/(DQ3L)/(DQ1L)) N7(IO,_DIFFIO_L49p) N8(IO,_DIFFIO_L42n) P1(IO,_DIFFIO_L32n,_(DQ1L)/(DQ3L)/(DQ1L)) P2(IO,_DIFFIO_L32p,_(DQ1L)/(DQ3L)/(DQ1L)) P3(IO,_DIFFIO_L34n,_(DQ1L)/(DQ3L)/(DQ1L)) P4(IO,_DIFFIO_L34p,_(DQS1L/CQ1L#,DPCLK1)/(DQS1L/CQ1L#,DPCLK1)/(DQS1L/CQ1L#,DPCLK1)) P5(IO,_VREFB2N1) P6(IO,_DIFFIO_L52p) P7(IO,_DIFFIO_L49n) R1(IO,_DIFFIO_L33n,_(DQ1L)/(DQ3L)/(DQ1L)) R2(IO,_DIFFIO_L33p,_(DQ1L)/(DQ3L)/(DQ1L)) R5(IO,_VREFB2N3) R6(IO) R7(IO,_DIFFIO_L53p) R14(IO,_DIFFIO_B52p) R15(IO,_DIFFIO_B52n) R16(IO,_PLL4_CLKOUTn) T3(IO,_VREFB2N2) T4(IO,_(DQS3L/CQ3L#,CDPCLK1)/(DQS3L/CQ3L#,CDPCLK1)/(DQS3L/CQ3L#,CDPCLK1)) T5(IO,_(DM3L/BWS#3L)/(DM3L/BWS#3L)/(DM1L/BWS#1L)) T7(IO,_DIFFIO_L53n) T8(IO,_DIFFIO_B11p) T9(IO,_DIFFIO_B11n) T10(IO,_DIFFIO_B15p) T11(IO,_DIFFIO_B15n) T12(IO,_DIFFIO_B36p) T13(IO,_DIFFIO_B36n) T14(IO,_DIFFIO_B42p) T15(IO,_DIFFIO_B42n,_(DQ2B)/(DQ5B)/(DQ5B)) T16(IO,_PLL4_CLKOUTp) U1(IO,_DIFFIO_L35n,_(DQ3L)/(DQ3L)/(DQ1L)) U2(IO,_DIFFIO_L35p,_(DM1L/BWS#1L)/(DM3L/BWS#3L)/(DM1L/BWS#1L)) U7(IO,_DIFFIO_B3p) U8(IO,_DIFFIO_B3n) U9(IO,_DIFFIO_B13p,_(DQ3B)/(DQ3B)/(DQ5B)) U10(IO,_DIFFIO_B17n,_(DQ5B)/(DQ3B)/(DQ5B)) U11(IO,_VREFB3N0) U12(IO,_DIFFIO_B34p,_(DQ4B)/(DQ5B)/(DQ5B)) U13(IO,_DIFFIO_B38n) U14(IO,_DIFFIO_B39n) U15(IO,_DIFFIO_B40p) U16(IO,_DIFFIO_B50p) U17(IO,_DIFFIO_B50n) V1(IO,_DIFFIO_L38n,_(DQ3L)/(DQ3L)/(DQ1L)) V2(IO,_DIFFIO_L38p,_(DQ3L)/(DQ3L)/(DQ1L)) V3(IO,_RDN1) V4(IO,_RUP1) V5(IO,_DIFFIO_B1n,_(DM3B/BWS#3B)/(DM3B/BWS#3B)/(DM5B/BWS#5B)) V6(IO,_DIFFIO_B1p) V7(IO,_DIFFIO_B7n) V8(IO,_DIFFIO_B13n,_(DQ3B)/(DQ3B)/(DQ5B)) V9(IO,_VREFB3N1) V10(IO,_DIFFIO_B16p,_(DQS3B/CQ3B#,DPCLK2)/(DQS3B/CQ3B#,DPCLK2)/(DQS3B/CQ3B#,DPCLK2)) V14(IO,_DIFFIO_B39p,_(DQ2B)/(DQ5B)/(DQ5B)) V15(IO,_DIFFIO_B40n,_(DQ2B)/(DQ5B)/(DQ5B)) V16(IO,_VREFB4N0) W1(IO,_DIFFIO_L44n,_(DQ3L)/(DQ3L)/(DQ1L)) W2(IO,_DIFFIO_L44p,_(DQ3L)/(DQ3L)/(DQ1L)) W6(IO,_DIFFIO_B7p,_(DQ3B)/(DQ3B)/(DQ5B)) W8(IO,_(DQ3B)/(DQ3B)/(DQ5B)) W17(IO,_DIFFIO_B48p,_(DQ2B)/(DQ5B)/(DQ5B)) Y1(IO,_DIFFIO_L45n,_(DQ3L)/(DQ3L)/(DQ1L)) Y2(IO,_DIFFIO_L45p,_(DQ3L)/(DQ3L)/(DQ1L)) Y3(IO,_DIFFIO_B4p,_(DQ3B)/(DQ3B)/(DQ5B)) Y4(IO,_VREFB3N3) Y6(IO,_DIFFIO_B6p,_(DQS1B/CQ1B#,CDPCLK2)/(DQS1B/CQ1B#,CDPCLK2)/(DQS1B/CQ1B#,CDPCLK2)) Y17(IO,_DIFFIO_B48n,_(DQS0B/CQ1B,CDPCLK3)/(DQS0B/CQ1B,CDPCLK3)/(DQS0B/CQ1B,CDPCLK3))

### Notes on the sheet
- (in symbol EP4CE30F23C7, part A) BANK 1
- (in symbol EP4CE30F23C7, part B) BANK 2
- (in symbol EP4CE30F23C7, part C) BANK 3
- (in symbol EP4CE30F23C7, part D) BANK 4

### Library data of the parts
U1 = EP4CE30F23C7: Cyclone IV Family FPGA, 1.2V Core, 328 I/O Pins, 4 PLLs, 484-Pin FBGA, Speed Grade 7, Commercial Grade; Manufacturer: Altera; DatasheetVersion: ver1.6, Nov-2011; PackageVersion: ver1.0, Jun-2011; PackageReference: FBGA484_A-240; PackageDescription: 484-Pin FineLine Ball Grid Array (FBGA) - Wire Bond - A:2.40; Code_JEDEC: MS-034-AAJ-1; ComponentLink1Description: Manufacturer URL; ComponentLink1URL: http://www.altera.com/; ComponentLink2Description: Handbook; ComponentLink2URL: http://www.altera.com/literature/hb/cyclone-iv/cyclone4-handbook.pdf; ComponentLink3Description: Pinout; ComponentLink3URL: http://www.altera.com/literature/lit-dp.jsp?category=cyc%204&showspreadsheet=y; ComponentLink4Description: Package Specification; ComponentLink4URL: http://www.altera.com/devicepackaging/04R00247-02.pdf

## Sheet ep4ce30_b.SchDoc: EP4CE30F23 - B
size OrCAD B; CheckedBy: liuchao; DrawnBy: liuchao; DocumentNumber: APEX-USB2; Revision: 3.0.0; SheetNumber: 2; SheetTotal: 9
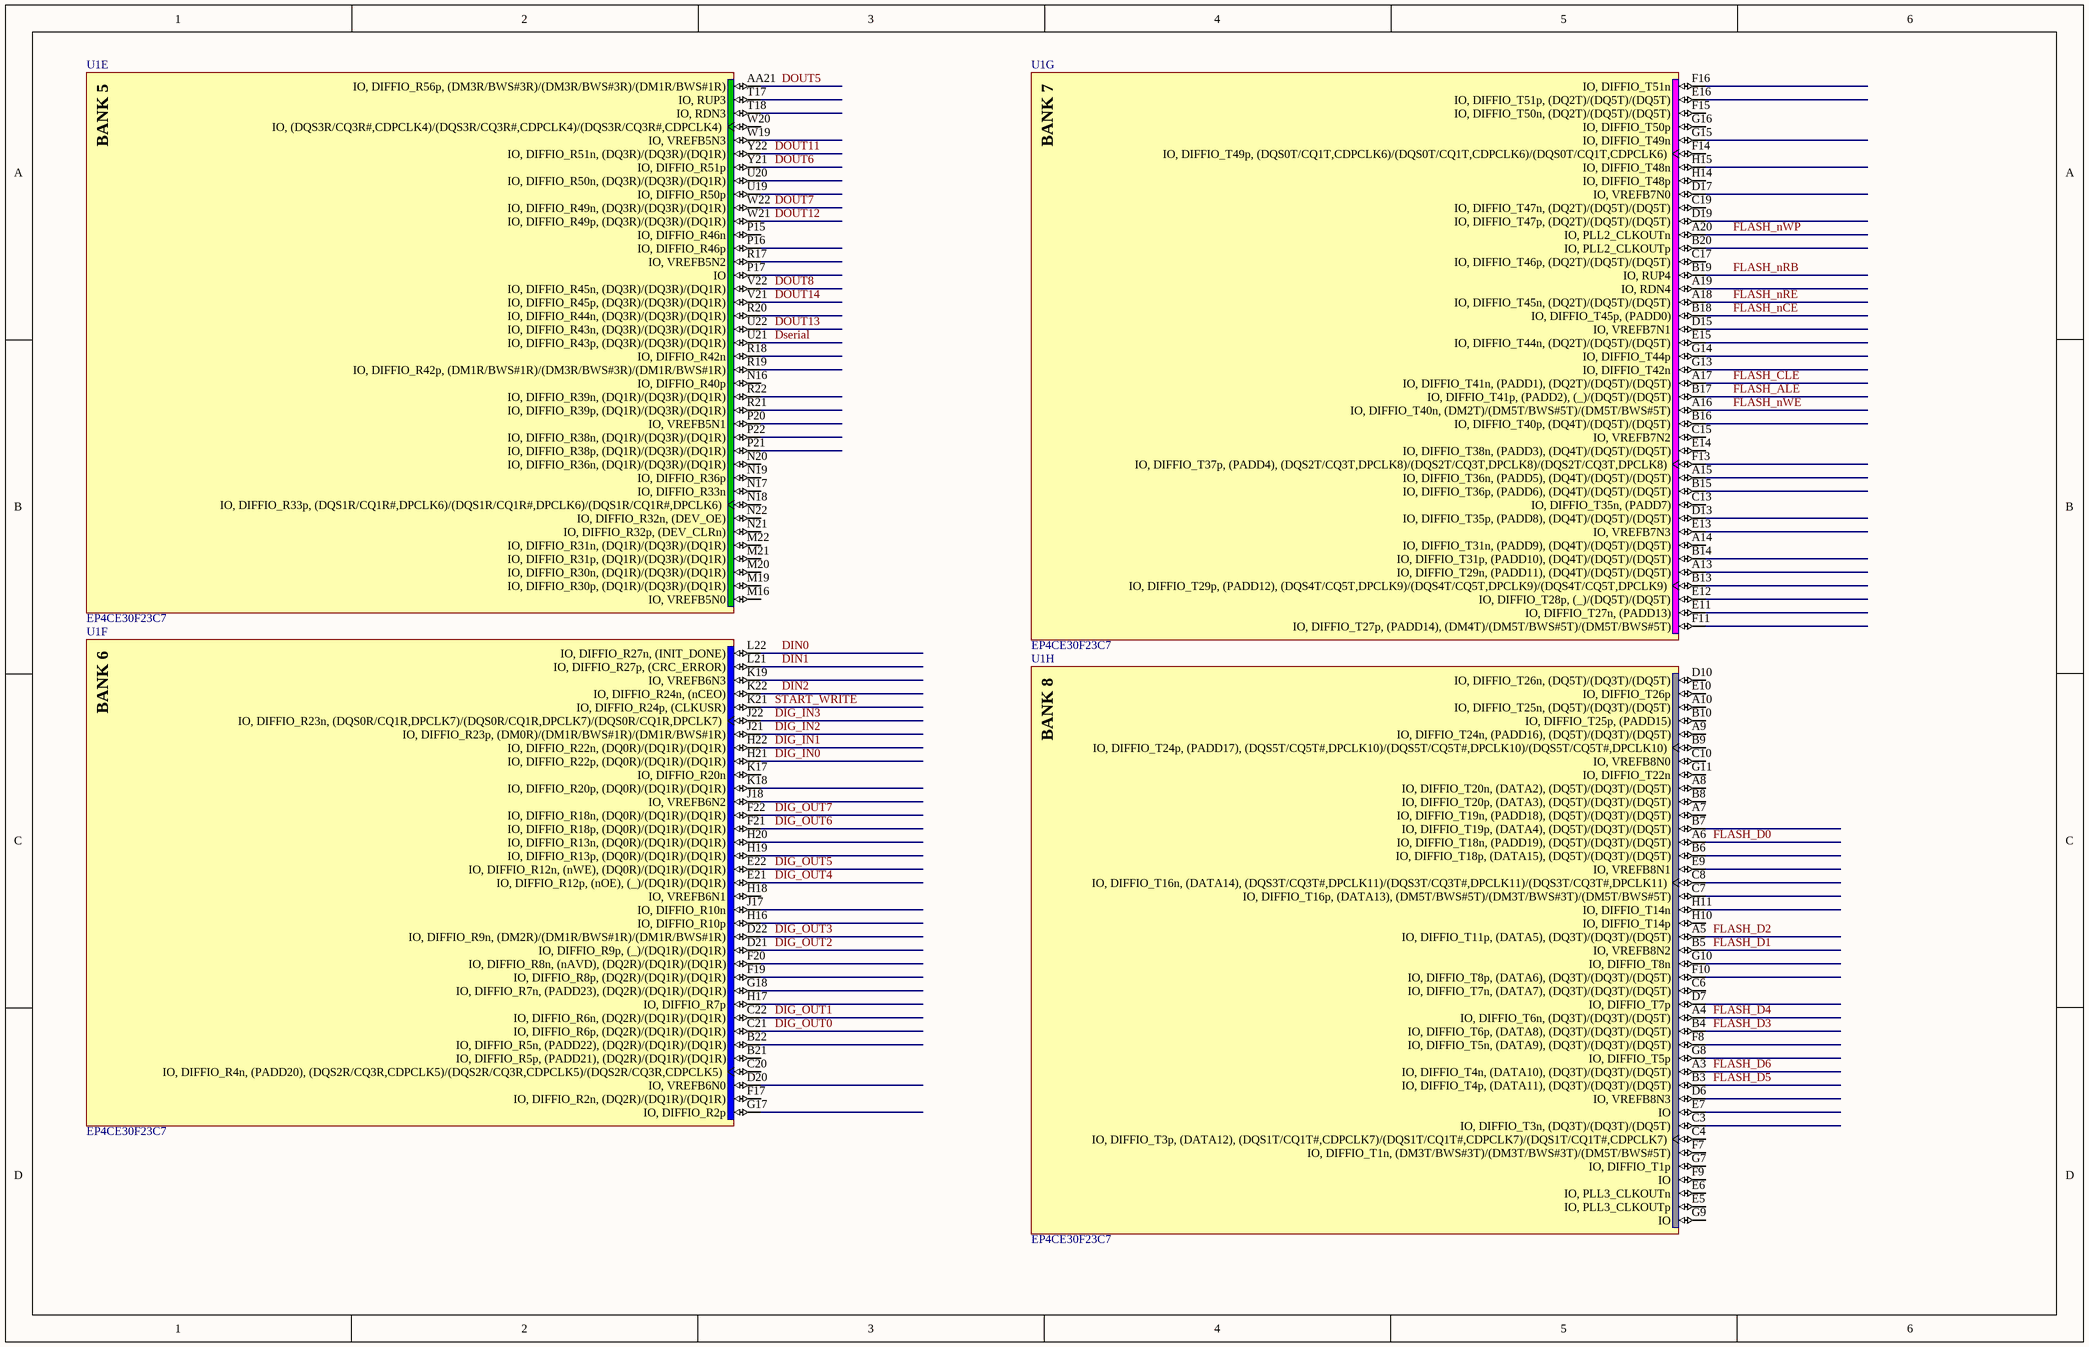
[diagram p4: ep4ce30_b.SchDoc]

### Parts
U1  EP4CE30F23C7  [FBGA484_A-240]  (parts E,F,G,H of 13)

### Nets
DIG_IN0: U1.H21(IO,_DIFFIO_R22p,_(DQ0R)/(DQ1R)/(DQ1R))
DIG_IN1: U1.H22(IO,_DIFFIO_R22n,_(DQ0R)/(DQ1R)/(DQ1R))
DIG_IN2: U1.J21(IO,_DIFFIO_R23p,_(DM0R)/(DM1R/BWS#1R)/(DM1R/BWS#1R))
DIG_IN3: U1.J22(IO,_DIFFIO_R23n,_(DQS0R/CQ1R,DPCLK7)/(DQS0R/CQ1R,DPCLK7)/(DQS0R/CQ1R,DPCLK7))
DIG_OUT0: U1.C21(IO,_DIFFIO_R6p,_(DQ2R)/(DQ1R)/(DQ1R))
DIG_OUT1: U1.C22(IO,_DIFFIO_R6n,_(DQ2R)/(DQ1R)/(DQ1R))
DIG_OUT2: U1.D21(IO,_DIFFIO_R9p,_(_)/(DQ1R)/(DQ1R))
DIG_OUT3: U1.D22(IO,_DIFFIO_R9n,_(DM2R)/(DM1R/BWS#1R)/(DM1R/BWS#1R))
DIG_OUT4: U1.E21(IO,_DIFFIO_R12p,_(nOE),_(_)/(DQ1R)/(DQ1R))
DIG_OUT5: U1.E22(IO,_DIFFIO_R12n,_(nWE),_(DQ0R)/(DQ1R)/(DQ1R))
DIG_OUT6: U1.F21(IO,_DIFFIO_R18p,_(DQ0R)/(DQ1R)/(DQ1R))
DIG_OUT7: U1.F22(IO,_DIFFIO_R18n,_(DQ0R)/(DQ1R)/(DQ1R))
DIN0: U1.L22(IO,_DIFFIO_R27n,_(INIT_DONE))
DIN1: U1.L21(IO,_DIFFIO_R27p,_(CRC_ERROR))
DIN2: U1.K22(IO,_DIFFIO_R24n,_(nCEO))
DOUT5: U1.AA21(IO,_DIFFIO_R56p,_(DM3R/BWS#3R)/(DM3R/BWS#3R)/(DM1R/BWS#1R))
DOUT6: U1.Y21(IO,_DIFFIO_R51p)
DOUT7: U1.W22(IO,_DIFFIO_R49n,_(DQ3R)/(DQ3R)/(DQ1R))
DOUT8: U1.V22(IO,_DIFFIO_R45n,_(DQ3R)/(DQ3R)/(DQ1R))
DOUT11: U1.Y22(IO,_DIFFIO_R51n,_(DQ3R)/(DQ3R)/(DQ1R))
DOUT12: U1.W21(IO,_DIFFIO_R49p,_(DQ3R)/(DQ3R)/(DQ1R))
DOUT13: U1.U22(IO,_DIFFIO_R43n,_(DQ3R)/(DQ3R)/(DQ1R))
DOUT14: U1.V21(IO,_DIFFIO_R45p,_(DQ3R)/(DQ3R)/(DQ1R))
Dserial: U1.U21(IO,_DIFFIO_R43p,_(DQ3R)/(DQ3R)/(DQ1R))
FLASH_ALE: U1.B17(IO,_DIFFIO_T41p,_(PADD2),_(_)/(DQ5T)/(DQ5T))
FLASH_CLE: U1.A17(IO,_DIFFIO_T41n,_(PADD1),_(DQ2T)/(DQ5T)/(DQ5T))
FLASH_D0: U1.A6(IO,_DIFFIO_T18n,_(PADD19),_(DQ5T)/(DQ3T)/(DQ5T))
FLASH_D1: U1.B5(IO,_VREFB8N2)
FLASH_D2: U1.A5(IO,_DIFFIO_T11p,_(DATA5),_(DQ3T)/(DQ3T)/(DQ5T))
FLASH_D3: U1.B4(IO,_DIFFIO_T6p,_(DATA8),_(DQ3T)/(DQ3T)/(DQ5T))
FLASH_D4: U1.A4(IO,_DIFFIO_T6n,_(DQ3T)/(DQ3T)/(DQ5T))
FLASH_D5: U1.B3(IO,_DIFFIO_T4p,_(DATA11),_(DQ3T)/(DQ3T)/(DQ5T))
FLASH_D6: U1.A3(IO,_DIFFIO_T4n,_(DATA10),_(DQ3T)/(DQ3T)/(DQ5T))
FLASH_nCE: U1.B18(IO,_DIFFIO_T45p,_(PADD0))
FLASH_nRB: U1.B19(IO,_RUP4)
FLASH_nRE: U1.A18(IO,_DIFFIO_T45n,_(DQ2T)/(DQ5T)/(DQ5T))
FLASH_nWE: U1.A16(IO,_DIFFIO_T40n,_(DM2T)/(DM5T/BWS#5T)/(DM5T/BWS#5T))
FLASH_nWP: U1.A20(IO,_PLL2_CLKOUTn)
START_WRITE: U1.K21(IO,_DIFFIO_R24p,_(CLKUSR))

Not connected (* = marked no-connect by the designer): U1 A7(IO,_DIFFIO_T19n,_(PADD18),_(DQ5T)/(DQ3T)/(DQ5T)) A8(IO,_DIFFIO_T20n,_(DATA2),_(DQ5T)/(DQ3T)/(DQ5T)) A9(IO,_DIFFIO_T24n,_(PADD16),_(DQ5T)/(DQ3T)/(DQ5T)) A10(IO,_DIFFIO_T25n,_(DQ5T)/(DQ3T)/(DQ5T)) A13(IO,_DIFFIO_T29n,_(PADD11),_(DQ4T)/(DQ5T)/(DQ5T)) A14(IO,_DIFFIO_T31n,_(PADD9),_(DQ4T)/(DQ5T)/(DQ5T)) A15(IO,_DIFFIO_T36n,_(PADD5),_(DQ4T)/(DQ5T)/(DQ5T)) A19(IO,_RDN4) B6(IO,_DIFFIO_T18p,_(DATA15),_(DQ5T)/(DQ3T)/(DQ5T)) B7(IO,_DIFFIO_T19p,_(DATA4),_(DQ5T)/(DQ3T)/(DQ5T)) B8(IO,_DIFFIO_T20p,_(DATA3),_(DQ5T)/(DQ3T)/(DQ5T)) B9(IO,_DIFFIO_T24p,_(PADD17),_(DQS5T/CQ5T#,DPCLK10)/(DQS5T/CQ5T#,DPCLK10)/(DQS5T/CQ5T#,DPCLK10)) B10(IO,_DIFFIO_T25p,_(PADD15)) B13(IO,_DIFFIO_T29p,_(PADD12),_(DQS4T/CQ5T,DPCLK9)/(DQS4T/CQ5T,DPCLK9)/(DQS4T/CQ5T,DPCLK9)) B14(IO,_DIFFIO_T31p,_(PADD10),_(DQ4T)/(DQ5T)/(DQ5T)) B15(IO,_DIFFIO_T36p,_(PADD6),_(DQ4T)/(DQ5T)/(DQ5T)) B16(IO,_DIFFIO_T40p,_(DQ4T)/(DQ5T)/(DQ5T)) B20(IO,_PLL2_CLKOUTp) B21(IO,_DIFFIO_R5p,_(PADD21),_(DQ2R)/(DQ1R)/(DQ1R)) B22(IO,_DIFFIO_R5n,_(PADD22),_(DQ2R)/(DQ1R)/(DQ1R)) C3(IO,_DIFFIO_T3n,_(DQ3T)/(DQ3T)/(DQ5T)) C4(IO,_DIFFIO_T3p,_(DATA12),_(DQS1T/CQ1T#,CDPCLK7)/(DQS1T/CQ1T#,CDPCLK7)/(DQS1T/CQ1T#,CDPCLK7)) C6(IO,_DIFFIO_T7n,_(DATA7),_(DQ3T)/(DQ3T)/(DQ5T)) C7(IO,_DIFFIO_T16p,_(DATA13),_(DM5T/BWS#5T)/(DM3T/BWS#3T)/(DM5T/BWS#5T)) C8(IO,_DIFFIO_T16n,_(DATA14),_(DQS3T/CQ3T#,DPCLK11)/(DQS3T/CQ3T#,DPCLK11)/(DQS3T/CQ3T#,DPCLK11)) C10(IO,_VREFB8N0) C13(IO,_DIFFIO_T35n,_(PADD7)) C15(IO,_VREFB7N2) C17(IO,_DIFFIO_T46p,_(DQ2T)/(DQ5T)/(DQ5T)) C19(IO,_DIFFIO_T47n,_(DQ2T)/(DQ5T)/(DQ5T)) C20(IO,_DIFFIO_R4n,_(PADD20),_(DQS2R/CQ3R,CDPCLK5)/(DQS2R/CQ3R,CDPCLK5)/(DQS2R/CQ3R,CDPCLK5)) D6(IO,_VREFB8N3) D7(IO,_DIFFIO_T7p) D10(IO,_DIFFIO_T26n,_(DQ5T)/(DQ3T)/(DQ5T)) D13(IO,_DIFFIO_T35p,_(PADD8),_(DQ4T)/(DQ5T)/(DQ5T)) D15(IO,_VREFB7N1) D17(IO,_VREFB7N0) D19(IO,_DIFFIO_T47p,_(DQ2T)/(DQ5T)/(DQ5T)) D20(IO,_VREFB6N0) E5(IO,_PLL3_CLKOUTp) E6(IO,_PLL3_CLKOUTn) E7(IO) E9(IO,_VREFB8N1) E10(IO,_DIFFIO_T26p) E11(IO,_DIFFIO_T27n,_(PADD13)) E12(IO,_DIFFIO_T28p,_(_)/(DQ5T)/(DQ5T)) E13(IO,_VREFB7N3) E14(IO,_DIFFIO_T38n,_(PADD3),_(DQ4T)/(DQ5T)/(DQ5T)) E15(IO,_DIFFIO_T44n,_(DQ2T)/(DQ5T)/(DQ5T)) E16(IO,_DIFFIO_T51p,_(DQ2T)/(DQ5T)/(DQ5T)) F7(IO,_DIFFIO_T1n,_(DM3T/BWS#3T)/(DM3T/BWS#3T)/(DM5T/BWS#5T)) F8(IO,_DIFFIO_T5n,_(DATA9),_(DQ3T)/(DQ3T)/(DQ5T)) F9(IO) F10(IO,_DIFFIO_T8p,_(DATA6),_(DQ3T)/(DQ3T)/(DQ5T)) F11(IO,_DIFFIO_T27p,_(PADD14),_(DM4T)/(DM5T/BWS#5T)/(DM5T/BWS#5T)) F13(IO,_DIFFIO_T37p,_(PADD4),_(DQS2T/CQ3T,DPCLK8)/(DQS2T/CQ3T,DPCLK8)/(DQS2T/CQ3T,DPCLK8)) F14(IO,_DIFFIO_T49p,_(DQS0T/CQ1T,CDPCLK6)/(DQS0T/CQ1T,CDPCLK6)/(DQS0T/CQ1T,CDPCLK6)) F15(IO,_DIFFIO_T50n,_(DQ2T)/(DQ5T)/(DQ5T)) F16(IO,_DIFFIO_T51n) F17(IO,_DIFFIO_R2n,_(DQ2R)/(DQ1R)/(DQ1R)) F19(IO,_DIFFIO_R8p,_(DQ2R)/(DQ1R)/(DQ1R)) F20(IO,_DIFFIO_R8n,_(nAVD),_(DQ2R)/(DQ1R)/(DQ1R)) G7(IO,_DIFFIO_T1p) G8(IO,_DIFFIO_T5p) G9(IO) G10(IO,_DIFFIO_T8n) G11(IO,_DIFFIO_T22n) G13(IO,_DIFFIO_T42n) G14(IO,_DIFFIO_T44p) G15(IO,_DIFFIO_T49n) G16(IO,_DIFFIO_T50p) G17(IO,_DIFFIO_R2p) G18(IO,_DIFFIO_R7n,_(PADD23),_(DQ2R)/(DQ1R)/(DQ1R)) H10(IO,_DIFFIO_T14p) H11(IO,_DIFFIO_T14n) H14(IO,_DIFFIO_T48p) H15(IO,_DIFFIO_T48n) H16(IO,_DIFFIO_R10p) H17(IO,_DIFFIO_R7p) H18(IO,_VREFB6N1) H19(IO,_DIFFIO_R13p,_(DQ0R)/(DQ1R)/(DQ1R)) H20(IO,_DIFFIO_R13n,_(DQ0R)/(DQ1R)/(DQ1R)) J17(IO,_DIFFIO_R10n) J18(IO,_VREFB6N2) K17(IO,_DIFFIO_R20n) K18(IO,_DIFFIO_R20p,_(DQ0R)/(DQ1R)/(DQ1R)) K19(IO,_VREFB6N3) M16(IO,_VREFB5N0) M19(IO,_DIFFIO_R30p,_(DQ1R)/(DQ3R)/(DQ1R)) M20(IO,_DIFFIO_R30n,_(DQ1R)/(DQ3R)/(DQ1R)) M21(IO,_DIFFIO_R31p,_(DQ1R)/(DQ3R)/(DQ1R)) M22(IO,_DIFFIO_R31n,_(DQ1R)/(DQ3R)/(DQ1R)) N16(IO,_DIFFIO_R40p) N17(IO,_DIFFIO_R33n) N18(IO,_DIFFIO_R33p,_(DQS1R/CQ1R#,DPCLK6)/(DQS1R/CQ1R#,DPCLK6)/(DQS1R/CQ1R#,DPCLK6)) N19(IO,_DIFFIO_R36p) N20(IO,_DIFFIO_R36n,_(DQ1R)/(DQ3R)/(DQ1R)) N21(IO,_DIFFIO_R32p,_(DEV_CLRn)) N22(IO,_DIFFIO_R32n,_(DEV_OE)) P15(IO,_DIFFIO_R46n) P16(IO,_DIFFIO_R46p) P17(IO) P20(IO,_VREFB5N1) P21(IO,_DIFFIO_R38p,_(DQ1R)/(DQ3R)/(DQ1R)) P22(IO,_DIFFIO_R38n,_(DQ1R)/(DQ3R)/(DQ1R)) R17(IO,_VREFB5N2) R18(IO,_DIFFIO_R42n) R19(IO,_DIFFIO_R42p,_(DM1R/BWS#1R)/(DM3R/BWS#3R)/(DM1R/BWS#1R)) R20(IO,_DIFFIO_R44n,_(DQ3R)/(DQ3R)/(DQ1R)) R21(IO,_DIFFIO_R39p,_(DQ1R)/(DQ3R)/(DQ1R)) R22(IO,_DIFFIO_R39n,_(DQ1R)/(DQ3R)/(DQ1R)) T17(IO,_RUP3) T18(IO,_RDN3) U19(IO,_DIFFIO_R50p) U20(IO,_DIFFIO_R50n,_(DQ3R)/(DQ3R)/(DQ1R)) W19(IO,_VREFB5N3) W20(IO,_(DQS3R/CQ3R#,CDPCLK4)/(DQS3R/CQ3R#,CDPCLK4)/(DQS3R/CQ3R#,CDPCLK4))

### Notes on the sheet
- (in symbol EP4CE30F23C7, part E) BANK 5
- (in symbol EP4CE30F23C7, part F) BANK 6
- (in symbol EP4CE30F23C7, part G) BANK 7
- (in symbol EP4CE30F23C7, part H) BANK 8

### Library data of the parts
U1 = EP4CE30F23C7: as U1 on sheet ep4ce30_a; DatasheetVersion: ver1.6, Nov-2011; PackageVersion: ver1.0, Jun-2011; PackageReference: FBGA484_A-240; PackageDescription: 484-Pin FineLine Ball Grid Array (FBGA) - Wire Bond - A:2.40; Code_JEDEC: MS-034-AAJ-1; ComponentLink1Description: Manufacturer URL; ComponentLink1URL: http://www.altera.com/; ComponentLink2Description: Handbook; ComponentLink2URL: http://www.altera.com/literature/hb/cyclone-iv/cyclone4-handbook.pdf; ComponentLink3Description: Pinout; ComponentLink3URL: http://www.altera.com/literature/lit-dp.jsp?category=cyc%204&showspreadsheet=y; ComponentLink4Description: Package Specification; ComponentLink4URL: http://www.altera.com/devicepackaging/04R00247-02.pdf

## Sheet ep4ce30_c.SchDoc: EP4CEF23 - C
size OrCAD B; CheckedBy: liuchao; DrawnBy: liuchao; DocumentNumber: APEX-USB3; Revision: 3.0.0; SheetNumber: 3; SheetTotal: 9
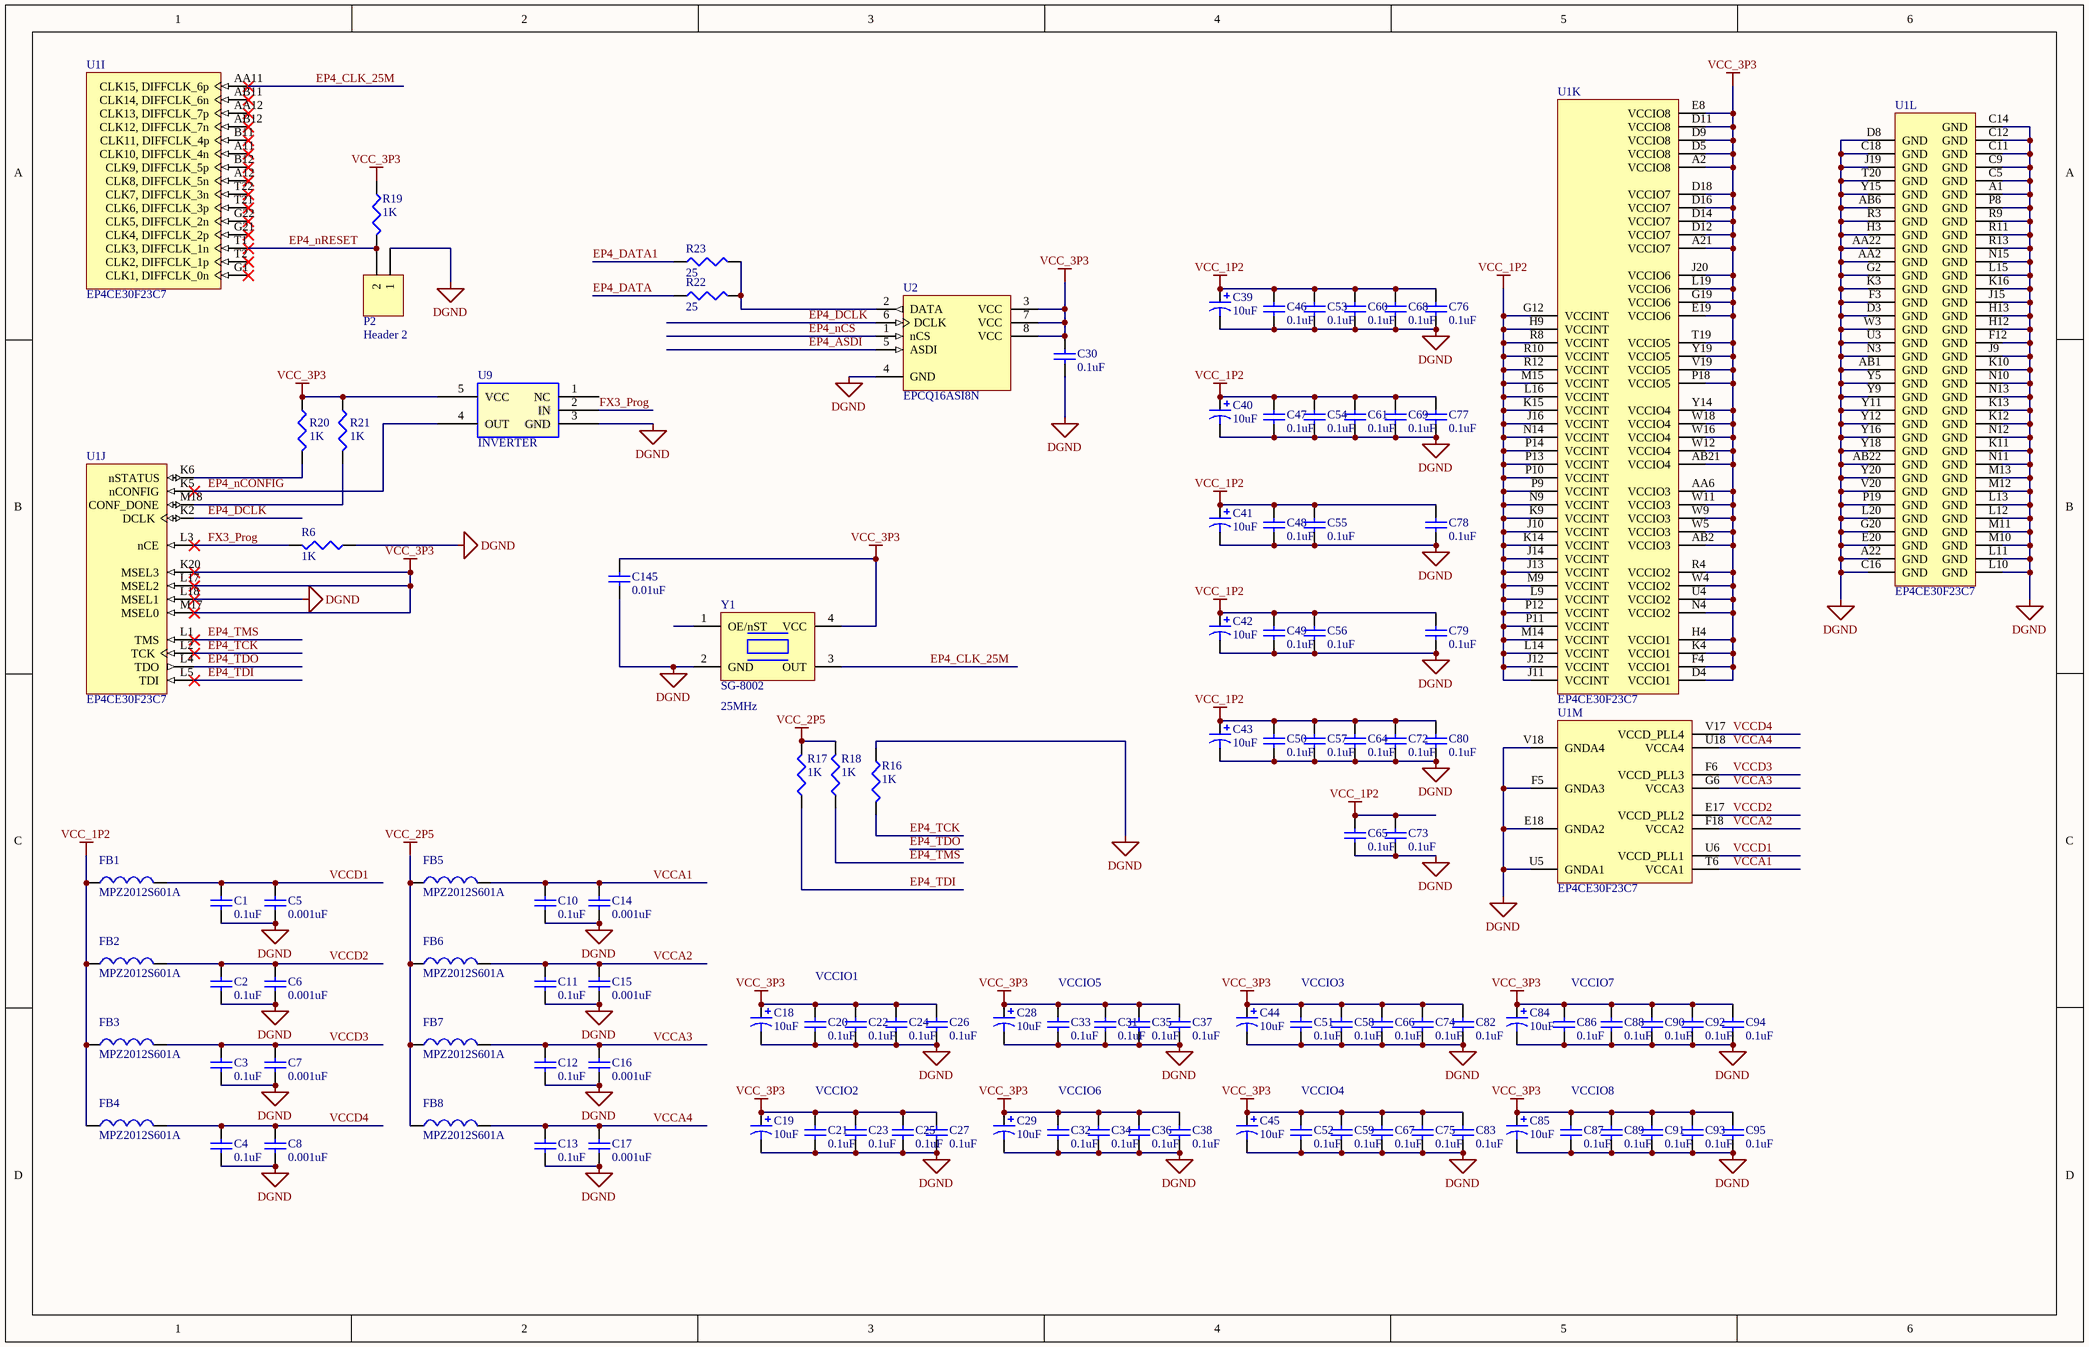
[diagram p5: ep4ce30_c.SchDoc]

### Parts
C1  value 0.1uF  [C_0402]  (hidden comment: Capacitor)
C2  value 0.1uF  [C_0402]  (hidden comment: Capacitor)
C3  value 0.1uF  [C_0402]  (hidden comment: Capacitor)
C4  value 0.1uF  [C_0402]  (hidden comment: Capacitor)
C5  value 0.001uF  [C_0402]  (hidden comment: Capacitor)
C6  value 0.001uF  [C_0402]  (hidden comment: Capacitor)
C7  value 0.001uF  [C_0402]  (hidden comment: Capacitor)
C8  value 0.001uF  [C_0402]  (hidden comment: Capacitor)
C10  value 0.1uF  [C_0402]  (hidden comment: Capacitor)
C11  value 0.1uF  [C_0402]  (hidden comment: Capacitor)
C12  value 0.1uF  [C_0402]  (hidden comment: Capacitor)
C13  value 0.1uF  [C_0402]  (hidden comment: Capacitor)
C14  value 0.001uF  [C_0402]  (hidden comment: Capacitor)
C15  value 0.001uF  [C_0402]  (hidden comment: Capacitor)
C16  value 0.001uF  [C_0402]  (hidden comment: Capacitor)
C17  value 0.001uF  [C_0402]  (hidden comment: Capacitor)
C18  value 10uF  [CAP_B]  (hidden comment: Polarized Capacitor)
C19  value 10uF  [CAP_B]  (hidden comment: Polarized Capacitor)
C20  value 0.1uF  [C_0402]  (hidden comment: Capacitor)
C21  value 0.1uF  [C_0402]  (hidden comment: Capacitor)
C22  value 0.1uF  [C_0402]  (hidden comment: Capacitor)
C23  value 0.1uF  [C_0402]  (hidden comment: Capacitor)
C24  value 0.1uF  [C_0402]  (hidden comment: Capacitor)
C25  value 0.1uF  [C_0402]  (hidden comment: Capacitor)
C26  value 0.1uF  [C_0402]  (hidden comment: Capacitor)
C27  value 0.1uF  [C_0402]  (hidden comment: Capacitor)
C28  value 10uF  [CAP_B]  (hidden comment: Polarized Capacitor)
C29  value 10uF  [CAP_B]  (hidden comment: Polarized Capacitor)
C30  value 0.1uF  [C_0402]  (hidden comment: Capacitor)
C31  value 0.1uF  [C_0402]  (hidden comment: Capacitor)
C32  value 0.1uF  [C_0402]  (hidden comment: Capacitor)
C33  value 0.1uF  [C_0402]  (hidden comment: Capacitor)
C34  value 0.1uF  [C_0402]  (hidden comment: Capacitor)
C35  value 0.1uF  [C_0402]  (hidden comment: Capacitor)
C36  value 0.1uF  [C_0402]  (hidden comment: Capacitor)
C37  value 0.1uF  [C_0402]  (hidden comment: Capacitor)
C38  value 0.1uF  [C_0402]  (hidden comment: Capacitor)
C39  value 10uF  [CAP_B]  (hidden comment: Polarized Capacitor)
C40  value 10uF  [CAP_B]  (hidden comment: Polarized Capacitor)
C41  value 10uF  [CAP_B]  (hidden comment: Polarized Capacitor)
C42  value 10uF  [CAP_B]  (hidden comment: Polarized Capacitor)
C43  value 10uF  [CAP_B]  (hidden comment: Polarized Capacitor)
C44  value 10uF  [CAP_B]  (hidden comment: Polarized Capacitor)
C45  value 10uF  [CAP_B]  (hidden comment: Polarized Capacitor)
C46  value 0.1uF  [C_0402]  (hidden comment: Capacitor)
C47  value 0.1uF  [C_0402]  (hidden comment: Capacitor)
C48  value 0.1uF  [C_0402]  (hidden comment: Capacitor)
C49  value 0.1uF  [C_0402]  (hidden comment: Capacitor)
C50  value 0.1uF  [C_0402]  (hidden comment: Capacitor)
C51  value 0.1uF  [C_0402]  (hidden comment: Capacitor)
C52  value 0.1uF  [C_0402]  (hidden comment: Capacitor)
C53  value 0.1uF  [C_0402]  (hidden comment: Capacitor)
C54  value 0.1uF  [C_0402]  (hidden comment: Capacitor)
C55  value 0.1uF  [C_0402]  (hidden comment: Capacitor)
C56  value 0.1uF  [C_0402]  (hidden comment: Capacitor)
C57  value 0.1uF  [C_0402]  (hidden comment: Capacitor)
C58  value 0.1uF  [C_0402]  (hidden comment: Capacitor)
C59  value 0.1uF  [C_0402]  (hidden comment: Capacitor)
C60  value 0.1uF  [C_0402]  (hidden comment: Capacitor)
C61  value 0.1uF  [C_0402]  (hidden comment: Capacitor)
C64  value 0.1uF  [C_0402]  (hidden comment: Capacitor)
C65  value 0.1uF  [C_0402]  (hidden comment: Capacitor)
C66  value 0.1uF  [C_0402]  (hidden comment: Capacitor)
C67  value 0.1uF  [C_0402]  (hidden comment: Capacitor)
C68  value 0.1uF  [C_0402]  (hidden comment: Capacitor)
C69  value 0.1uF  [C_0402]  (hidden comment: Capacitor)
C72  value 0.1uF  [C_0402]  (hidden comment: Capacitor)
C73  value 0.1uF  [C_0402]  (hidden comment: Capacitor)
C74  value 0.1uF  [C_0402]  (hidden comment: Capacitor)
C75  value 0.1uF  [C_0402]  (hidden comment: Capacitor)
C76  value 0.1uF  [C_0402]  (hidden comment: Capacitor)
C77  value 0.1uF  [C_0402]  (hidden comment: Capacitor)
C78  value 0.1uF  [C_0402]  (hidden comment: Capacitor)
C79  value 0.1uF  [C_0402]  (hidden comment: Capacitor)
C80  value 0.1uF  [C_0402]  (hidden comment: Capacitor)
C82  value 0.1uF  [C_0402]  (hidden comment: Capacitor)
C83  value 0.1uF  [C_0402]  (hidden comment: Capacitor)
C84  value 10uF  [CAP_B]  (hidden comment: Polarized Capacitor)
C85  value 10uF  [CAP_B]  (hidden comment: Polarized Capacitor)
C86  value 0.1uF  [C_0402]  (hidden comment: Capacitor)
C87  value 0.1uF  [C_0402]  (hidden comment: Capacitor)
C88  value 0.1uF  [C_0402]  (hidden comment: Capacitor)
C89  value 0.1uF  [C_0402]  (hidden comment: Capacitor)
C90  value 0.1uF  [C_0402]  (hidden comment: Capacitor)
C91  value 0.1uF  [C_0402]  (hidden comment: Capacitor)
C92  value 0.1uF  [C_0402]  (hidden comment: Capacitor)
C93  value 0.1uF  [C_0402]  (hidden comment: Capacitor)
C94  value 0.1uF  [C_0402]  (hidden comment: Capacitor)
C95  value 0.1uF  [C_0402]  (hidden comment: Capacitor)
C145  value 0.01uF  [C_0402]  (hidden comment: Capacitor)
FB1  MPZ2012S601A  [SMD_0805]
FB2  MPZ2012S601A  [SMD_0805]
FB3  MPZ2012S601A  [SMD_0805]
FB4  MPZ2012S601A  [SMD_0805]
FB5  MPZ2012S601A  [SMD_0805]
FB6  MPZ2012S601A  [SMD_0805]
FB7  MPZ2012S601A  [SMD_0805]
FB8  MPZ2012S601A  [SMD_0805]
P2  Header 2  [HDR1X2]
R6  value 1K  [J1-0603]  (hidden comment: Resistor)
R16  value 1K  [J1-0603]  (hidden comment: Resistor)
R17  value 1K  [J1-0603]  (hidden comment: Resistor)
R18  value 1K  [J1-0603]  (hidden comment: Resistor)
R19  value 1K  [J1-0603]  (hidden comment: Resistor)
R20  value 1K  [J1-0603]  (hidden comment: Resistor)
R21  value 1K  [J1-0603]  (hidden comment: Resistor)
R22  value 25  [J1-0603]  (hidden comment: Resistor)
R23  value 25  [J1-0603]  (hidden comment: Resistor)
U1  EP4CE30F23C7  [FBGA484_A-240]  (parts I,J,K,L,M of 13)
U2  EPCQ16ASI8N  [SOIC8_N]
U9  INVERTER  [TC7SET08FU]
Y1  SG-8002  [SON_4]

### Nets
DGND: C1.2 C2.2 C3.2 C4.1 C5.2 C6.2 C7.2 C8.2 C10.1 C11.1 C12.1 C13.1 C14.2 C15.2 C16.2 C17.2 C18.2 C19.2 C20.2 C21.2 C22.2 C23.2 C24.2 C25.2 C26.2 C27.2 C28.2 C29.2 C30.2 C31.2 C32.2 C33.2 C34.2 C35.2 C36.2 C37.2 C38.2 C39.2 C40.2 C41.2 C42.2 C43.2 C44.2 C45.2 C46.2 C47.2 C48.2 C49.2 C50.2 C51.2 C52.2 C53.2 C54.2 C55.2 C56.2 C57.2 C58.2 C59.2 C60.2 C61.2 C64.2 C65.2 C66.2 C67.2 C68.2 C69.2 C72.2 C73.2 C74.2 C75.2 C76.2 C77.2 C78.2 C79.2 C80.2 C82.2 C83.2 C84.2 C85.2 C86.2 C87.2 C88.2 C89.2 C90.2 C91.2 C92.2 C93.2 C94.2 C95.2 C145.2 P2.1 R6.1 R16.1 U1.A1(GND) U1.A22(GND) U1.AA2(GND) U1.AA22(GND) U1.AB1(GND) U1.AB6(GND) U1.AB22(GND) U1.C5(GND) U1.C9(GND) U1.C11(GND) U1.C12(GND) U1.C14(GND) U1.C16(GND) U1.C18(GND) U1.D3(GND) U1.D8(GND) U1.E18(GNDA2) U1.E20(GND) U1.F3(GND) U1.F5(GNDA3) U1.F12(GND) U1.G2(GND) U1.G20(GND) U1.H3(GND) U1.H12(GND) U1.H13(GND) U1.J9(GND) U1.J15(GND) U1.J19(GND) U1.K3(GND) U1.K10(GND) U1.K11(GND) U1.K12(GND) U1.K13(GND) U1.K16(GND) U1.L10(GND) U1.L11(GND) U1.L12(GND) U1.L13(GND) U1.L15(GND) U1.L18(MSEL1) U1.L20(GND) U1.M10(GND) U1.M11(GND) U1.M12(GND) U1.M13(GND) U1.N3(GND) U1.N10(GND) U1.N11(GND) U1.N12(GND) U1.N13(GND) U1.N15(GND) U1.P8(GND) U1.P19(GND) U1.R3(GND) U1.R9(GND) U1.R11(GND) U1.R13(GND) U1.T20(GND) U1.U3(GND) U1.U5(GNDA1) U1.V18(GNDA4) U1.V20(GND) U1.W3(GND) U1.Y5(GND) U1.Y9(GND) U1.Y11(GND) U1.Y12(GND) U1.Y15(GND) U1.Y16(GND) U1.Y18(GND) U1.Y20(GND) U2.4(GND) U9.3(GND) Y1.2(GND)
VCC_1P2: C39.1 C40.1 C41.1 C42.1 C43.1 C46.1 C47.1 C48.1 C49.1 C50.1 C53.1 C54.1 C55.1 C56.1 C57.1 C60.1 C61.1 C64.1 C65.1 C68.1 C69.1 C72.1 C73.1 C76.1 C77.1 C78.1 C79.1 C80.1 FB1.1 FB2.1 FB3.1 FB4.1 U1.G12(VCCINT) U1.H9(VCCINT) U1.J10(VCCINT) U1.J11(VCCINT) U1.J12(VCCINT) U1.J13(VCCINT) U1.J14(VCCINT) U1.J16(VCCINT) U1.K9(VCCINT) U1.K14(VCCINT) U1.K15(VCCINT) U1.L9(VCCINT) U1.L14(VCCINT) U1.L16(VCCINT) U1.M9(VCCINT) U1.M14(VCCINT) U1.M15(VCCINT) U1.N9(VCCINT) U1.N14(VCCINT) U1.P9(VCCINT) U1.P10(VCCINT) U1.P11(VCCINT) U1.P12(VCCINT) U1.P13(VCCINT) U1.P14(VCCINT) U1.R8(VCCINT) U1.R10(VCCINT) U1.R12(VCCINT)
VCC_2P5: FB5.1 FB6.1 FB7.1 FB8.1 R17.2 R18.2
VCC_3P3: C18.1 C19.1 C20.1 C21.1 C22.1 C23.1 C24.1 C25.1 C26.1 C27.1 C28.1 C29.1 C30.1 C31.1 C32.1 C33.1 C34.1 C35.1 C36.1 C37.1 C38.1 C44.1 C45.1 C51.1 C52.1 C58.1 C59.1 C66.1 C67.1 C74.1 C75.1 C82.1 C83.1 C84.1 C85.1 C86.1 C87.1 C88.1 C89.1 C90.1 C91.1 C92.1 C93.1 C94.1 C95.1 C145.1 R19.1 R20.1 R21.1 U1.A2(VCCIO8) U1.A21(VCCIO7) U1.AA6(VCCIO3) U1.AB2(VCCIO3) U1.AB21(VCCIO4) U1.D4(VCCIO1) U1.D5(VCCIO8) U1.D9(VCCIO8) U1.D11(VCCIO8) U1.D12(VCCIO7) U1.D14(VCCIO7) U1.D16(VCCIO7) U1.D18(VCCIO7) U1.E8(VCCIO8) U1.E19(VCCIO6) U1.F4(VCCIO1) U1.G19(VCCIO6) U1.H4(VCCIO1) U1.J20(VCCIO6) U1.K4(VCCIO1) U1.K20(MSEL3) U1.L17(MSEL2) U1.L19(VCCIO6) U1.M17(MSEL0) U1.N4(VCCIO2) U1.P18(VCCIO5) U1.R4(VCCIO2) U1.T19(VCCIO5) U1.U4(VCCIO2) U1.V19(VCCIO5) U1.W4(VCCIO2) U1.W5(VCCIO3) U1.W9(VCCIO3) U1.W11(VCCIO3) U1.W12(VCCIO4) U1.W16(VCCIO4) U1.W18(VCCIO4) U1.Y14(VCCIO4) U1.Y19(VCCIO5) U2.3(VCC) U2.7(VCC) U2.8(VCC) U9.5(VCC) Y1.4(VCC)
EP4_ASDI: U2.5(ASDI)
EP4_CLK_25M: U1.AA11(CLK15,_DIFFCLK_6p) Y1.3(OUT)
EP4_DATA: R22.1
EP4_DATA1: R23.1
EP4_DCLK: U1.K2(DCLK) U2.6(DCLK)
EP4_nCONFIG: U1.K5(nCONFIG) U9.4(OUT)
EP4_nCS: U2.1(nCS)
EP4_nRESET: P2.2 R19.2 U1.T1(CLK3,_DIFFCLK_1n)
EP4_TCK: R16.2 U1.L2(TCK)
EP4_TDI: R17.1 U1.L5(TDI)
EP4_TDO: U1.L4(TDO)
EP4_TMS: R18.1 U1.L1(TMS)
FX3_Prog: R6.2 U1.L3(nCE) U9.2(IN)
VCCA1: C10.2 C14.1 FB5.2 U1.T6(VCCA1)
VCCA2: C11.2 C15.1 FB6.2 U1.F18(VCCA2)
VCCA3: C12.2 C16.1 FB7.2 U1.G6(VCCA3)
VCCA4: C13.2 C17.1 FB8.2 U1.U18(VCCA4)
VCCD1: C1.1 C5.1 FB1.2 U1.U6(VCCD_PLL1)
VCCD2: C2.1 C6.1 FB2.2 U1.E17(VCCD_PLL2)
VCCD3: C3.1 C7.1 FB3.2 U1.F6(VCCD_PLL3)
VCCD4: C4.2 C8.1 FB4.2 U1.V17(VCCD_PLL4)
NetR20_2: R20.2 U1.K6(nSTATUS)
NetR21_2: R21.2 U1.M18(CONF_DONE)
NetR22_2: R22.2 R23.2 U2.2(DATA)

Not connected (* = marked no-connect by the designer): U1 A11(CLK10,_DIFFCLK_4n)* A12(CLK8,_DIFFCLK_5n)* AA12(CLK13,_DIFFCLK_7p)* AB11(CLK14,_DIFFCLK_6n)* AB12(CLK12,_DIFFCLK_7n)* B11(CLK11,_DIFFCLK_4p)* B12(CLK9,_DIFFCLK_5p)* G1(CLK1,_DIFFCLK_0n)* G21(CLK4,_DIFFCLK_2p)* G22(CLK5,_DIFFCLK_2n)* T2(CLK2,_DIFFCLK_1p)* T21(CLK6,_DIFFCLK_3p)* T22(CLK7,_DIFFCLK_3n)*; U9 1(NC); Y1 1(OE/nST)

### Notes on the sheet
- (near Y1) 25MHz
- VCCIO1
- VCCIO5
- VCCIO3
- VCCIO7
- VCCIO2
- VCCIO6
- VCCIO4
- VCCIO8

### Library data of the parts
C1-C8 C10-C17 C20-C27 C30-C38 C46-C61 C64-C69 C72-C80 C82 C83 C86-C95 C145 = Cap Semi: Capacitor (Semiconductor SIM Model); Published: 8-Jun-2000; LatestRevisionDate: 29-May-2009; LatestRevisionNote: IPC-7351 Footprint Added.; PackageReference: C1206; Publisher: Altium Limited; PackageDescription: Chip Capacitor
C18 C19 C28 C29 C39-C45 C84 C85 = Cap Pol3: Polarized Capacitor (Surface Mount); Published: 8-Jun-2000; LatestRevisionDate: 29-May-2009; LatestRevisionNote: IPC-7351 Footprint Added.; PackageReference: C0805; Publisher: Altium Limited; PackageDescription: Chip Capacitor
FB1-FB8 = MPZ2012X
P2 = Header 2: Header, 2-Pin; LatestRevisionDate: 17-Jul-2002; LatestRevisionNote: Re-released for DXP Platform.; Publisher: Altium Limited
R6 R16-R23 = Res3: Published: 8-Jun-2000; LatestRevisionDate: 29-May-2009; LatestRevisionNote: IPC-7351 Footprint Added.; PackageReference: J1-0603; Publisher: Altium Limited; PackageDescription: Chip Resistor
U1 = EP4CE30F23C7: as U1 on sheet ep4ce30_a; DatasheetVersion: ver1.6, Nov-2011; PackageVersion: ver1.0, Jun-2011; PackageReference: FBGA484_A-240; PackageDescription: 484-Pin FineLine Ball Grid Array (FBGA) - Wire Bond - A:2.40; Code_JEDEC: MS-034-AAJ-1; ComponentLink1Description: Manufacturer URL; ComponentLink1URL: http://www.altera.com/; ComponentLink2Description: Handbook; ComponentLink2URL: http://www.altera.com/literature/hb/cyclone-iv/cyclone4-handbook.pdf; ComponentLink3Description: Pinout; ComponentLink3URL: http://www.altera.com/literature/lit-dp.jsp?category=cyc%204&showspreadsheet=y; ComponentLink4Description: Package Specification; ComponentLink4URL: http://www.altera.com/devicepackaging/04R00247-02.pdf
U2 = EPCS4SI8N: EPCS4 Series, In-system programmable 3.3V serial configuration device, 8-Pin SOIC, 4-Megabit, Industrial Grade, Pb-Free; Configures: Cyclone II, Stratix II, & Cyclone Devices; Published: 4-Mar-2005; LatestRevisionDate: 13-Apr-2006; LatestRevisionNote: IPC-7351 Footprint Added.; DatasheetVersion: ver2.0, Oct-2003; PackageVersion: ver14.2, Oct-2005; PackageReference: SOIC8; Publisher: Altium Limited; PackageDescription: 8-Pin Small Outline Integrated Circuit Package (SOIC8); Supplier 1: Digi-Key; Supplier Part Number 1: 544-1379-5-ND; Supplier 2: Farnell; Supplier Part Number 2: 1662262; Supplier 3: Farnell; Supplier Part Number 3: 1453496; Code_JEDEC: MS-012-AA; Code_IPC: SOIC127P600-8; ComponentLink1Description: Manufacturer Link; ComponentLink1URL: http://www.altera.com/products/devices/config/cfg-index.html; ComponentLink2Description: Configuration Handbook; ComponentLink2URL: http://www.altera.com/literature/hb/cfg/config_handbook.pdf; ComponentLink3Description: Pinout Specification; ComponentLink3URL: http://www.altera.com/literature/hb/cfg/cyc_c51014.pdf; ComponentLink4Description: Packaging Specification; ComponentLink4URL: http://www.altera.com/literature/ds/dspkg.pdf
Y1 = SG-8002: OSC XO CMOS SMD